# EAGLE schematic zulu_a7 (EAGLE 9.7.0), part 1 of 2
AUTHOR: Christian Tambe; VERSION#: 1.0

## Sheet 1 of 7: Block Diagram
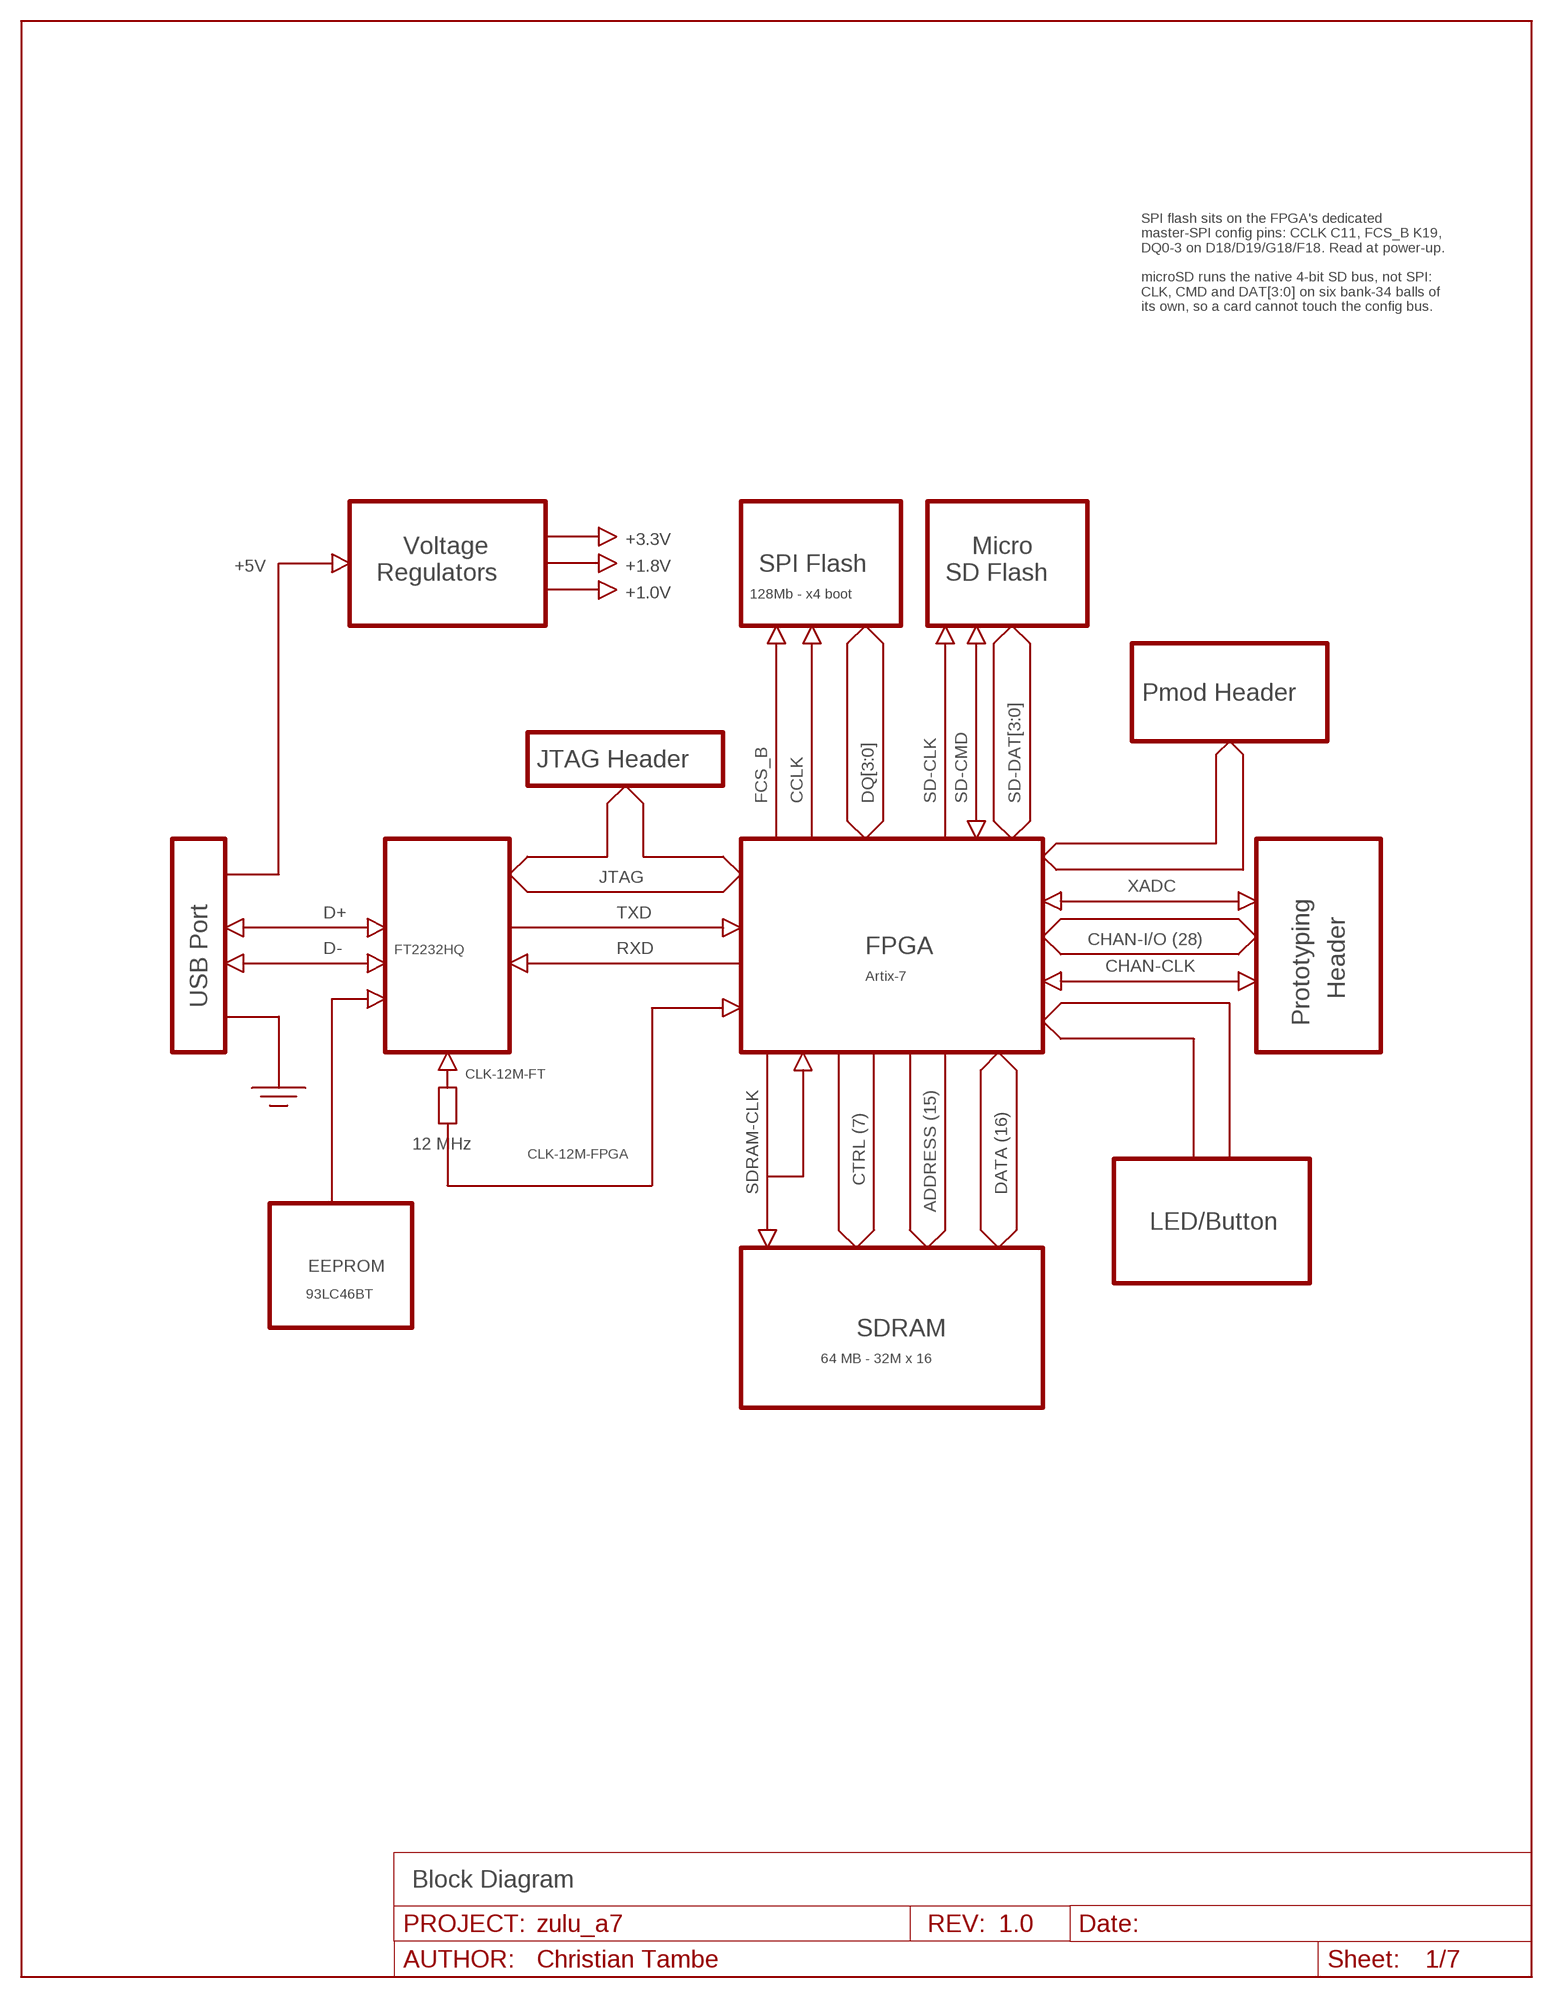
[diagram p0: schematic, sheet 1]

### Notes on the sheet
- SPI flash sits on the FPGA's dedicated
  master-SPI config pins: CCLK C11, FCS_B K19,
  DQ0-3 on D18/D19/G18/F18. Read at power-up.
  
  microSD runs the native 4-bit SD bus, not SPI:
  CLK, CMD and DAT[3:0] on six bank-34 balls of
  its own, so a card cannot touch the config bus.
- +3.3V
- Voltage | Micro
- +5V | +1.8V | SPI Flash
- Regulators | SD Flash
- +1.0V | 128Mb - x4 boot
- Pmod Header
- JTAG Header
- FCS_B | CCLK | DQ[3:0] | SD-CLK | SD-CMD | SD-DAT[3:0]
- JTAG
- XADC
- D+ | TXD
- CHAN-I/O (28)
- D- | FT2232HQ | RXD | FPGA
- CHAN-CLK
- Artix-7
- Header
- USB Port
- Prototyping
- CLK-12M-FT
- 12 MHz
- CLK-12M-FPGA
- CTRL (7)
- SDRAM-CLK | DATA (16)
- ADDRESS (15)
- LED/Button
- EEPROM
- 93LC46BT
- SDRAM
- 64 MB - 32M x 16
- Block Diagram

## Sheet 2 of 7: Power Supplies
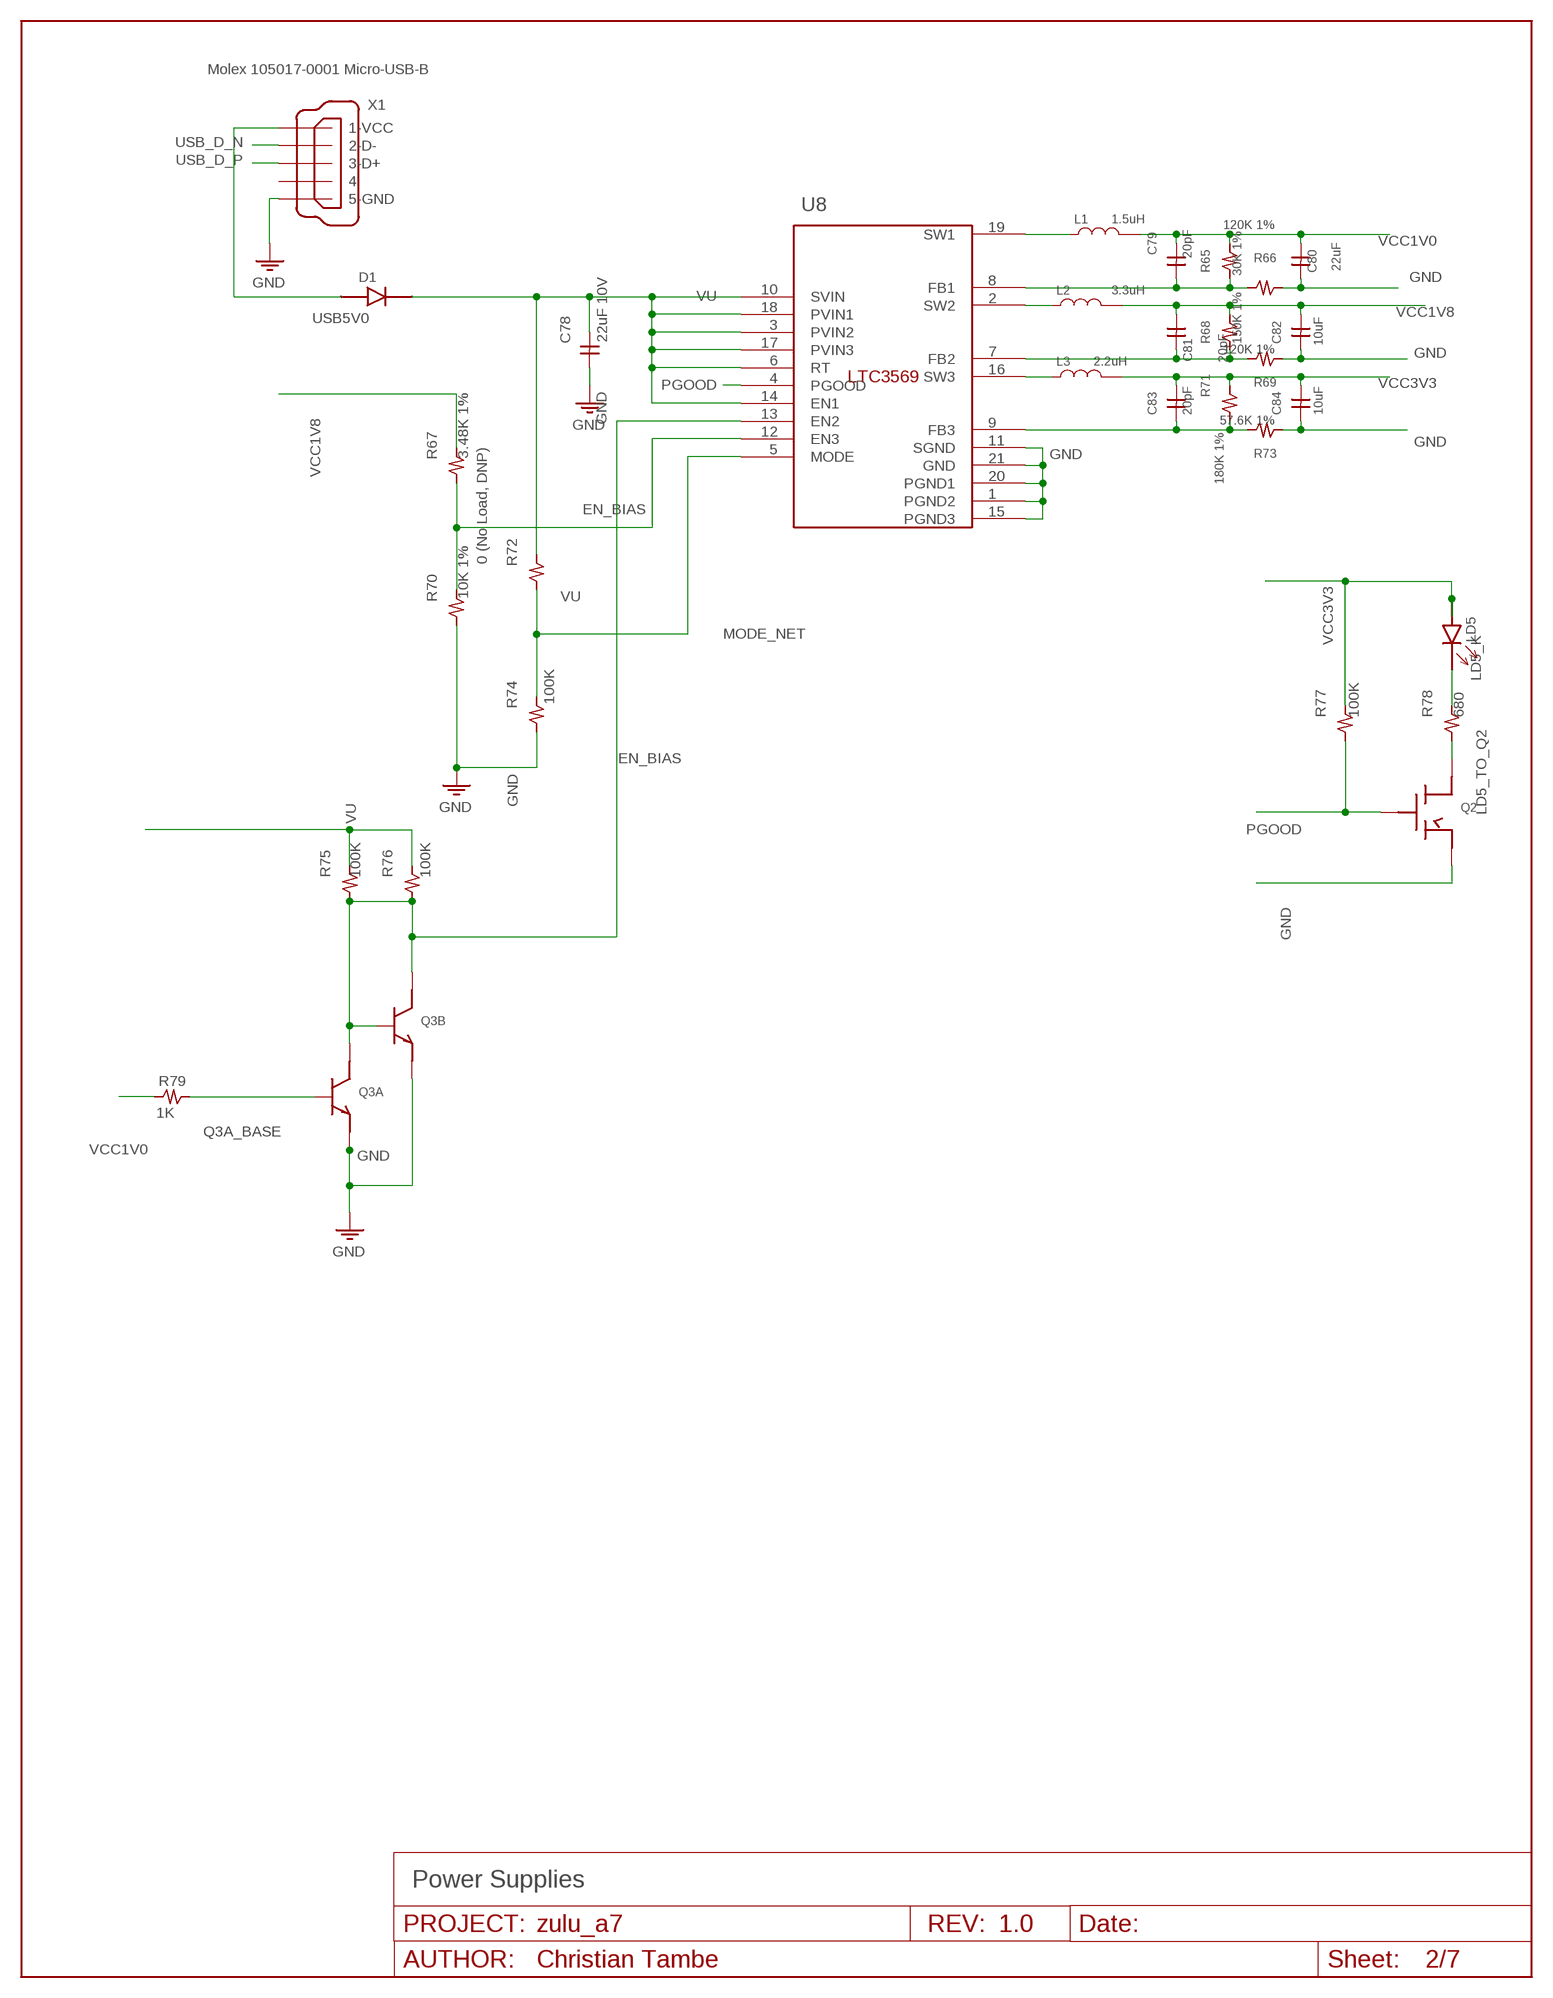
[diagram p1: schematic, sheet 2]

### Parts
C78  22uF 10V  C-GENERICC0805  [C0805]
C79  20pF  C-GENERICC0402  [C0402]
C80  22uF  C-GENERICC0805  [C0805]
C81  20pF  C-GENERICC0402  [C0402]
C82  10uF  C-GENERICC0603  [C0603]
C83  20pF  C-GENERICC0402  [C0402]
C84  10uF  C-GENERICC0603  [C0603]
D1  PMEG2020EJ,115  DIODE  [SOD123]
L1  1.5uH  INDUCTOR-2520  [IND2520]
L2  3.3uH  INDUCTOR-2520  [IND2520]
L3  2.2uH  INDUCTOR-2520  [IND2520]
LD5  green  LED  [LED0603]
Q2  2N7002  NMOS  [SOT23-3]
Q3  MBT3904DW1T1  NPN-DUAL  [SOT363]
R65  30K 1%  R-US_SMALLR0402  [R0402]
R66  120K 1%  R-US_SMALLR0402  [R0402]
R67  3.48K 1%  R-US_SMALLR0402  [R0402]
R68  150K 1%  R-US_SMALLR0402  [R0402]
R69  120K 1%  R-US_SMALLR0402  [R0402]
R70  10K 1%  R-US_SMALLR0402  [R0402]
R71  180K 1%  R-US_SMALLR0402  [R0402]
R72  0 (No Load, DNP)  R-US_SMALLR0402  [R0402]
R73  57.6K 1%  R-US_SMALLR0402  [R0402]
R74  100K  R-US_SMALLR0402  [R0402]
R75  100K  R-US_SMALLR0402  [R0402]
R76  100K  R-US_SMALLR0402  [R0402]
R77  100K  R-US_SMALLR0402  [R0402]
R78  680  R-US_SMALLR0402  [R0402]
R79  1K  R-US_SMALLR0402  [R0402]
U8  LTC3569EUDC#TRPBF  LTC3569-UDC  [LTC3569-QFN20]
X1  Molex 105017-0001 Micro-USB-B  MINI-USB-105017-0001  [MOLEX-105017-0001]

### Nets
EN_BIAS: Q3.4(B:B) Q3.5(B:C) Q3.6(A:C) R67.1 R70.2 R75.1 R76.1 U8.12(EN3) U8.13(EN2)
FB1_NODE: C79.1 R65.1 R66.2 U8.8(FB1)
FB2_NODE: C81.1 R68.1 R69.2 U8.7(FB2)
FB3_NODE: C83.1 R71.1 R73.2 U8.9(FB3)
GND: C78.1 C80.1 C82.1 C84.1 Q2.S Q3.2(A:E) Q3.3(B:E) R66.1 R69.1 R70.1 R73.1 R74.1 U8.1(PGND2) U8.11(SGND) U8.15(PGND3) U8.20(PGND1) U8.21(GND) X1.5(5-GND) X1.MH1(5-GND) X1.MH2(5-GND) X1.MP1(5-GND) X1.MP2(5-GND) X1.MP3(5-GND) X1.MP4(5-GND) X1.MS1(5-GND) X1.MS2(5-GND) ; also sheet 3,4,5,6,7
LD5_K: LD5.K R78.2
LD5_TO_Q2: Q2.D R78.1
MODE_NET: R72.1 R74.2 U8.5(MODE)
PGOOD: Q2.G R77.1 U8.4(PGOOD)
Q3A_BASE: Q3.1(A:B) R79.2
SW1_NET: L1.1 U8.19(SW1)
SW2_NET: L2.1 U8.2(SW2)
SW3_NET: L3.1 U8.16(SW3)
USB5V0: D1.A X1.1(1-VCC)
USB_D_N [usb-diff]: X1.2(2-D-) ; also sheet 5
USB_D_P [usb-diff]: X1.3(3-D+) ; also sheet 5
VCC1V0: C79.2 C80.2 L1.2 R65.2 R79.1 ; also sheet 3,6,7
VCC1V8: C81.2 C82.2 L2.2 R67.2 R68.2 ; also sheet 3,6,7
VCC3V3: C83.2 C84.2 L3.2 LD5.A R71.2 R77.2 ; also sheet 3,4,5,6,7
VU: C78.2 D1.K R72.2 R75.2 R76.2 U8.3(PVIN2) U8.6(RT) U8.10(SVIN) U8.14(EN1) U8.17(PVIN3) U8.18(PVIN1) ; also sheet 3
Unconnected: X1.4

### Notes on the sheet
- Power Supplies

## Sheet 3 of 7: General IO
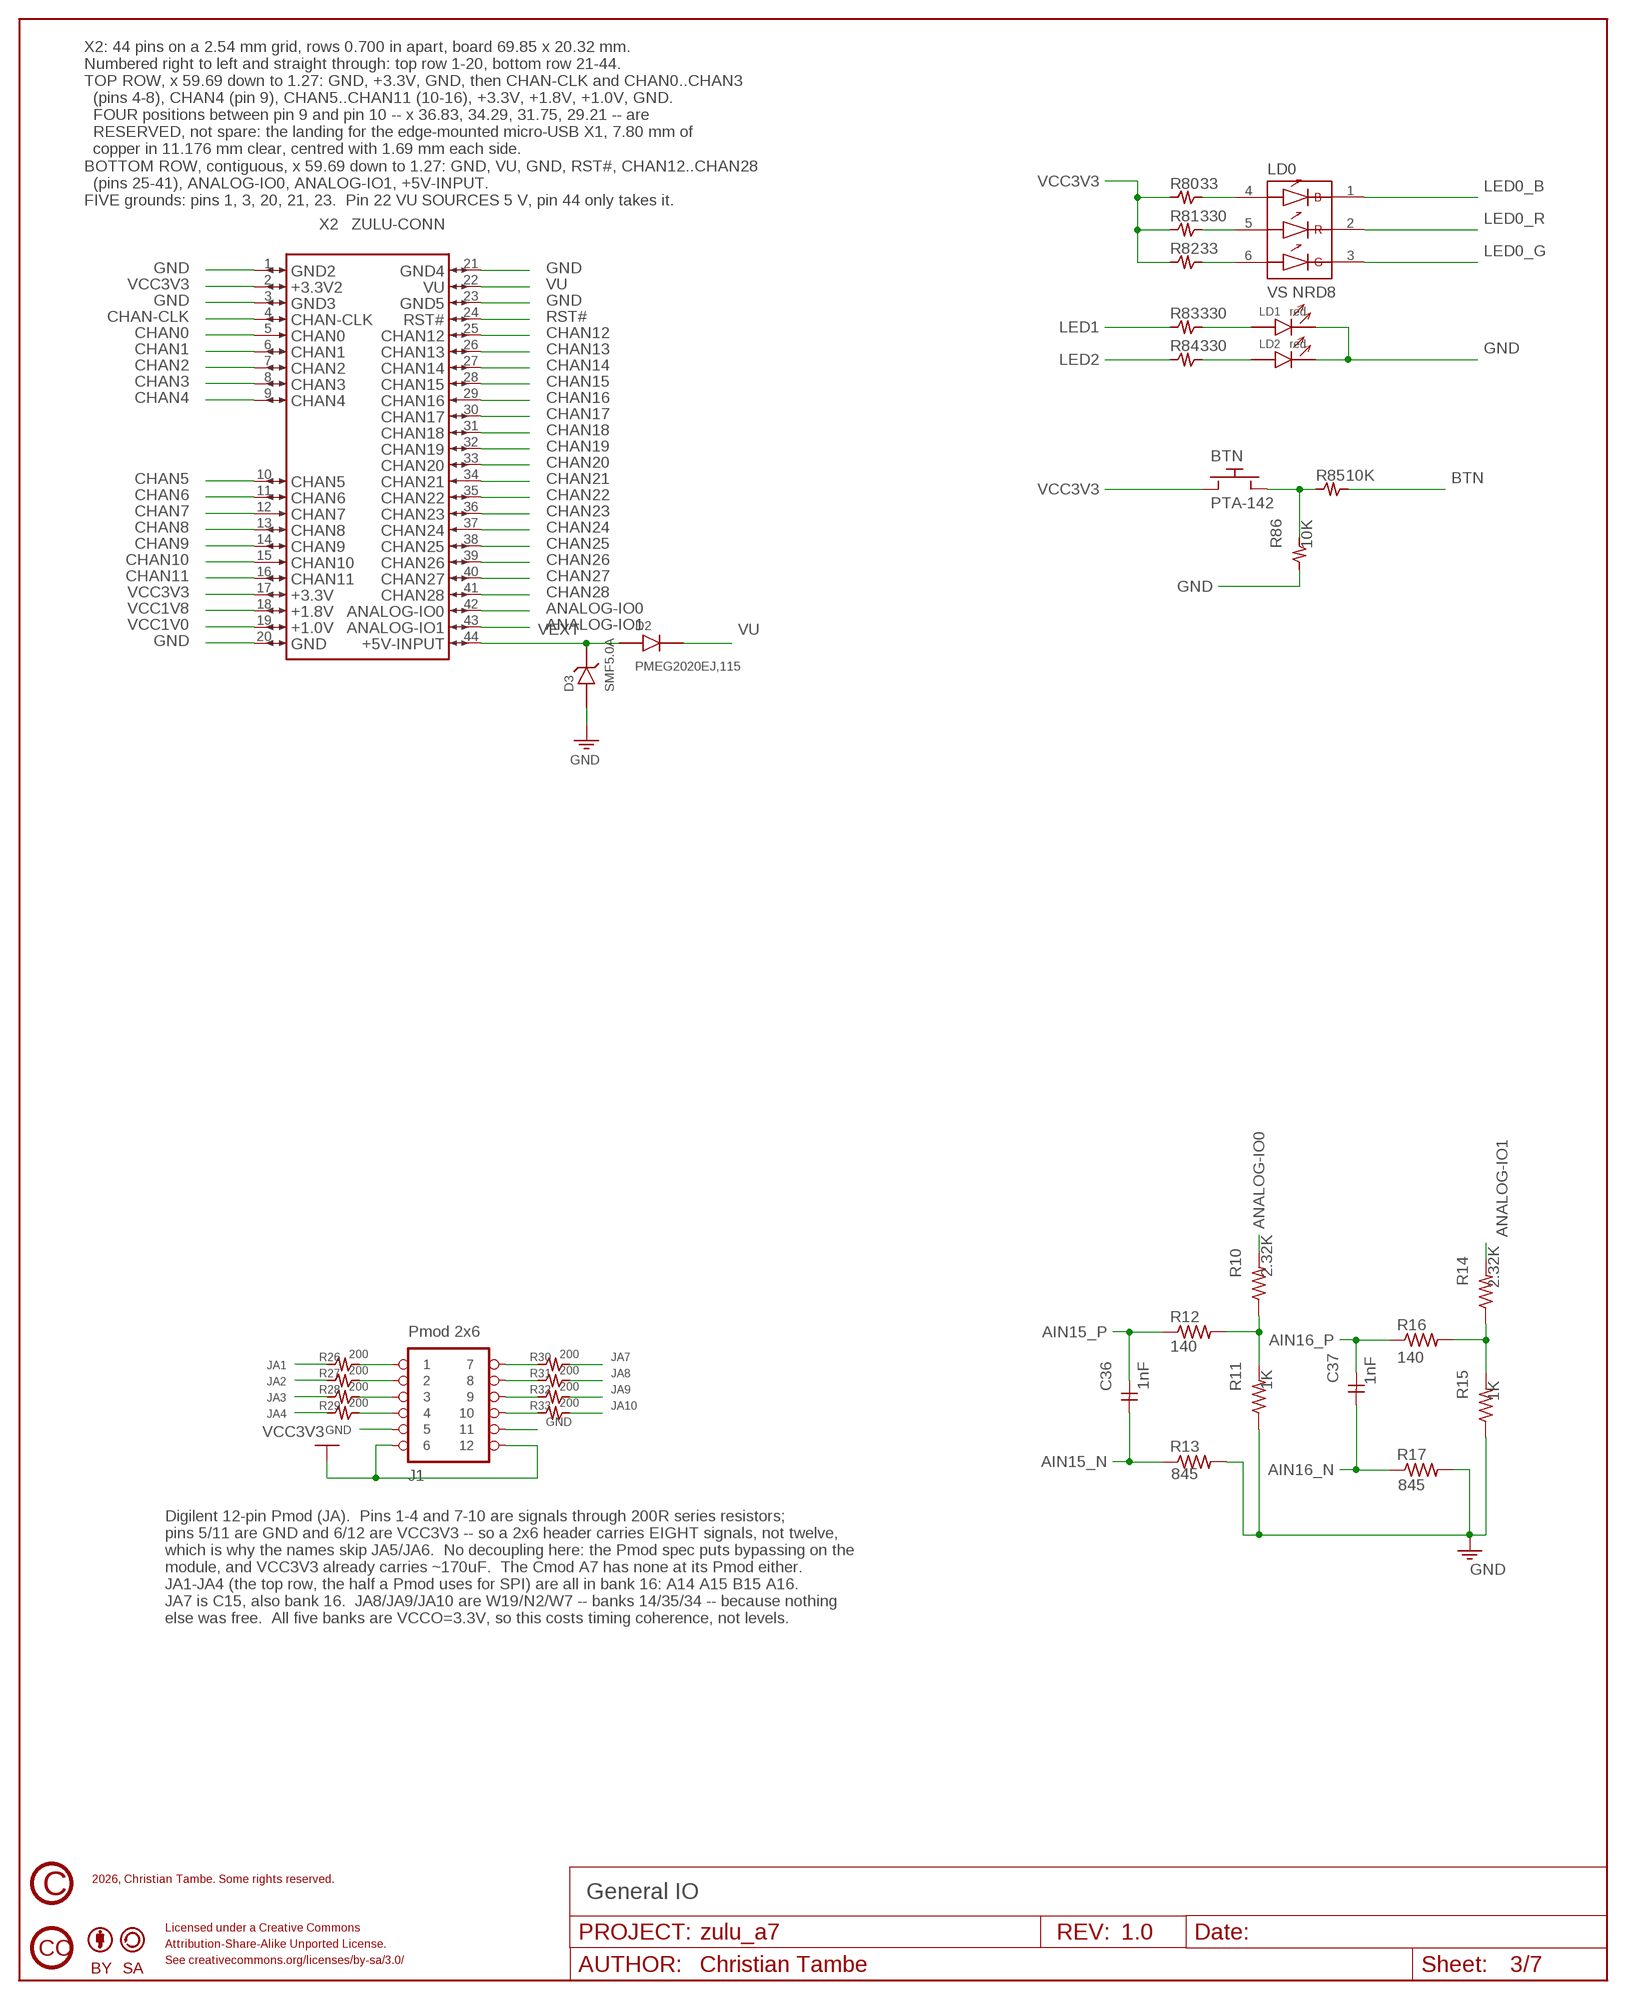
[diagram p2: schematic, sheet 3]

### Parts
BTN  PTA-142  SWITCH_TACT  [PTA-142]
C36  1nF  C-GENERICC0402  [C0402]
C37  1nF  C-GENERICC0402  [C0402]
D2  PMEG2020EJ,115  DIODE  [SOD123]
D3  SMF5.0A  TVS  [SOD123]
J1  Pmod 2x6  PINHD-2X6  [2X06]
LD0  VS NRD8  LED_RGB  [VS-NRD8]
LD1  red  LED  [LED0603]
LD2  red  LED  [LED0603]
R10  2.32K  R-US_R0201  [R0201]
R11  1K  R-US_R0201  [R0201]
R12  140  R-US_R0201  [R0201]
R13  845  R-US_R0201  [R0201]
R14  2.32K  R-US_R0201  [R0201]
R15  1K  R-US_R0201  [R0201]
R16  140  R-US_R0201  [R0201]
R17  845  R-US_R0201  [R0201]
R26  200  R-US_SMALLR0201  [R0201]
R27  200  R-US_SMALLR0201  [R0201]
R28  200  R-US_SMALLR0201  [R0201]
R29  200  R-US_SMALLR0201  [R0201]
R30  200  R-US_SMALLR0201  [R0201]
R31  200  R-US_SMALLR0201  [R0201]
R32  200  R-US_SMALLR0201  [R0201]
R33  200  R-US_SMALLR0201  [R0201]
R80  33  R-US_SMALLR0402  [R0402]
R81  330  R-US_SMALLR0402  [R0402]
R82  33  R-US_SMALLR0402  [R0402]
R83  330  R-US_SMALLR0402  [R0402]
R84  330  R-US_SMALLR0402  [R0402]
R85  10K  R-US_SMALLR0402  [R0402]
R86  10K  R-US_SMALLR0402  [R0402]
U$2  CC_CC  [CC_CC]
U$3  CC_BY  [CC_BY]
U$4  CC_SA  [CC_SA]
U$5  CC_COPYRIGHT  [CC_COPYRIGHT]
X2  ZULU-CONN  [ZULU-DIP37]

### Nets
AIN15_N: C36.1 R13.1 ; also sheet 6
AIN15_P: C36.2 R12.1 ; also sheet 6
AIN16_N: C37.1 R17.1 ; also sheet 6
AIN16_P: C37.2 R16.1 ; also sheet 6
ANALOG-IO0: R10.2 X2.42
ANALOG-IO1: R14.2 X2.43
BTN: R85.2 ; also sheet 6
CHAN0: X2.5 ; also sheet 6
CHAN1: X2.6 ; also sheet 6
CHAN2: X2.7 ; also sheet 6
CHAN3: X2.8 ; also sheet 6
CHAN4: X2.9 ; also sheet 6
CHAN5: X2.10 ; also sheet 6
CHAN6: X2.11 ; also sheet 6
CHAN7: X2.12 ; also sheet 6
CHAN8: X2.13 ; also sheet 6
CHAN9: X2.14 ; also sheet 6
CHAN10: X2.15 ; also sheet 6
CHAN11: X2.16 ; also sheet 6
CHAN12: X2.25 ; also sheet 6
CHAN13: X2.26 ; also sheet 6
CHAN14: X2.27 ; also sheet 6
CHAN15: X2.28 ; also sheet 6
CHAN16: X2.29 ; also sheet 6
CHAN17: X2.30 ; also sheet 6
CHAN18: X2.31 ; also sheet 6
CHAN19: X2.32 ; also sheet 6
CHAN20: X2.33 ; also sheet 6
CHAN21: X2.34 ; also sheet 6
CHAN22: X2.35 ; also sheet 6
CHAN23: X2.36 ; also sheet 6
CHAN24: X2.37 ; also sheet 6
CHAN25: X2.38 ; also sheet 6
CHAN26: X2.39 ; also sheet 6
CHAN27: X2.40 ; also sheet 6
CHAN28: X2.41 ; also sheet 6
CHAN-CLK: X2.4 ; also sheet 6
GND: D3.A J1.5 J1.11 LD1.K LD2.K R11.1 R13.2 R15.1 R17.2 R86.1 X2.1 X2.3 X2.20 X2.21 X2.23 ; also sheet 2,4,5,6,7
JA1: R26.1 ; also sheet 6
JA2: R27.1 ; also sheet 6
JA3: R28.1 ; also sheet 6
JA4: R29.1 ; also sheet 6
JA7: R30.2 ; also sheet 6
JA8: R31.2 ; also sheet 6
JA9: R32.2 ; also sheet 6
JA10: R33.2 ; also sheet 6
LED0_B: LD0.1 ; also sheet 6
LED0_G: LD0.3 ; also sheet 6
LED0_R: LD0.2 ; also sheet 6
LED1: R83.1 ; also sheet 6
LED2: R84.1 ; also sheet 6
N$BTN: BTN.3 BTN.4 R85.1 R86.2
N$LD0B: LD0.4 R80.2
N$LD0G: LD0.6 R82.2
N$LD0R: LD0.5 R81.2
N$LD1A: LD1.A R83.2
N$LD2A: LD2.A R84.2
NODE_P0: R10.1 R11.2 R12.2
NODE_P1: R14.1 R15.2 R16.2
PMOD-1: J1.1 R26.2
PMOD-2: J1.2 R27.2
PMOD-3: J1.3 R28.2
PMOD-4: J1.4 R29.2
PMOD-7: J1.7 R30.1
PMOD-8: J1.8 R31.1
PMOD-9: J1.9 R32.1
PMOD-10: J1.10 R33.1
RST#: X2.24 ; also sheet 5,6
VCC1V0: X2.19 ; also sheet 2,6,7
VCC1V8: X2.18 ; also sheet 2,6,7
VCC3V3: BTN.1 BTN.2 J1.6 J1.12 R80.1 R81.1 R82.1 X2.2 X2.17 ; also sheet 2,4,5,6,7
VEXT: D2.A D3.K X2.44
VU: D2.K X2.22 ; also sheet 2

### Notes on the sheet
- X2: 44 pins on a 2.54 mm grid, rows 0.700 in apart, board 69.85 x 20.32 mm.
  Numbered right to left and straight through: top row 1-20, bottom row 21-44.
  TOP ROW, x 59.69 down to 1.27: GND, +3.3V, GND, then CHAN-CLK and CHAN0..CHAN3
    (pins 4-8), CHAN4 (pin 9), CHAN5..CHAN11 (10-16), +3.3V, +1.8V, +1.0V, GND.
    FOUR positions between pin 9 and pin 10 -- x 36.83, 34.29, 31.75, 29.21 -- are
    RESERVED, not spare: the landing for the edge-mounted micro-USB X1, 7.80 mm of
    copper in 11.176 mm clear, centred with 1.69 mm each side.
  BOTTOM ROW, contiguous, x 59.69 down to 1.27: GND, VU, GND, RST#, CHAN12..CHAN28
    (pins 25-41), ANALOG-IO0, ANALOG-IO1, +5V-INPUT.
  FIVE grounds: pins 1, 3, 20, 21, 23.  Pin 22 VU SOURCES 5 V, pin 44 only takes it.
- Digilent 12-pin Pmod (JA).  Pins 1-4 and 7-10 are signals through 200R series resistors;
  pins 5/11 are GND and 6/12 are VCC3V3 -- so a 2x6 header carries EIGHT signals, not twelve,
  which is why the names skip JA5/JA6.  No decoupling here: the Pmod spec puts bypassing on the
  module, and VCC3V3 already carries ~170uF.  The Cmod A7 has none at its Pmod either.
  JA1-JA4 (the top row, the half a Pmod uses for SPI) are all in bank 16: A14 A15 B15 A16.
  JA7 is C15, also bank 16.  JA8/JA9/JA10 are W19/N2/W7 -- banks 14/35/34 -- because nothing
  else was free.  All five banks are VCCO=3.3V, so this costs timing coherence, not levels.
- 2026, Christian Tambe. Some rights reserved.
- General IO
- Licensed under a Creative Commons
- Attribution-Share-Alike Unported License.
- See creativecommons.org/licenses/by-sa/3.0/

## Sheet 4 of 7: Memory
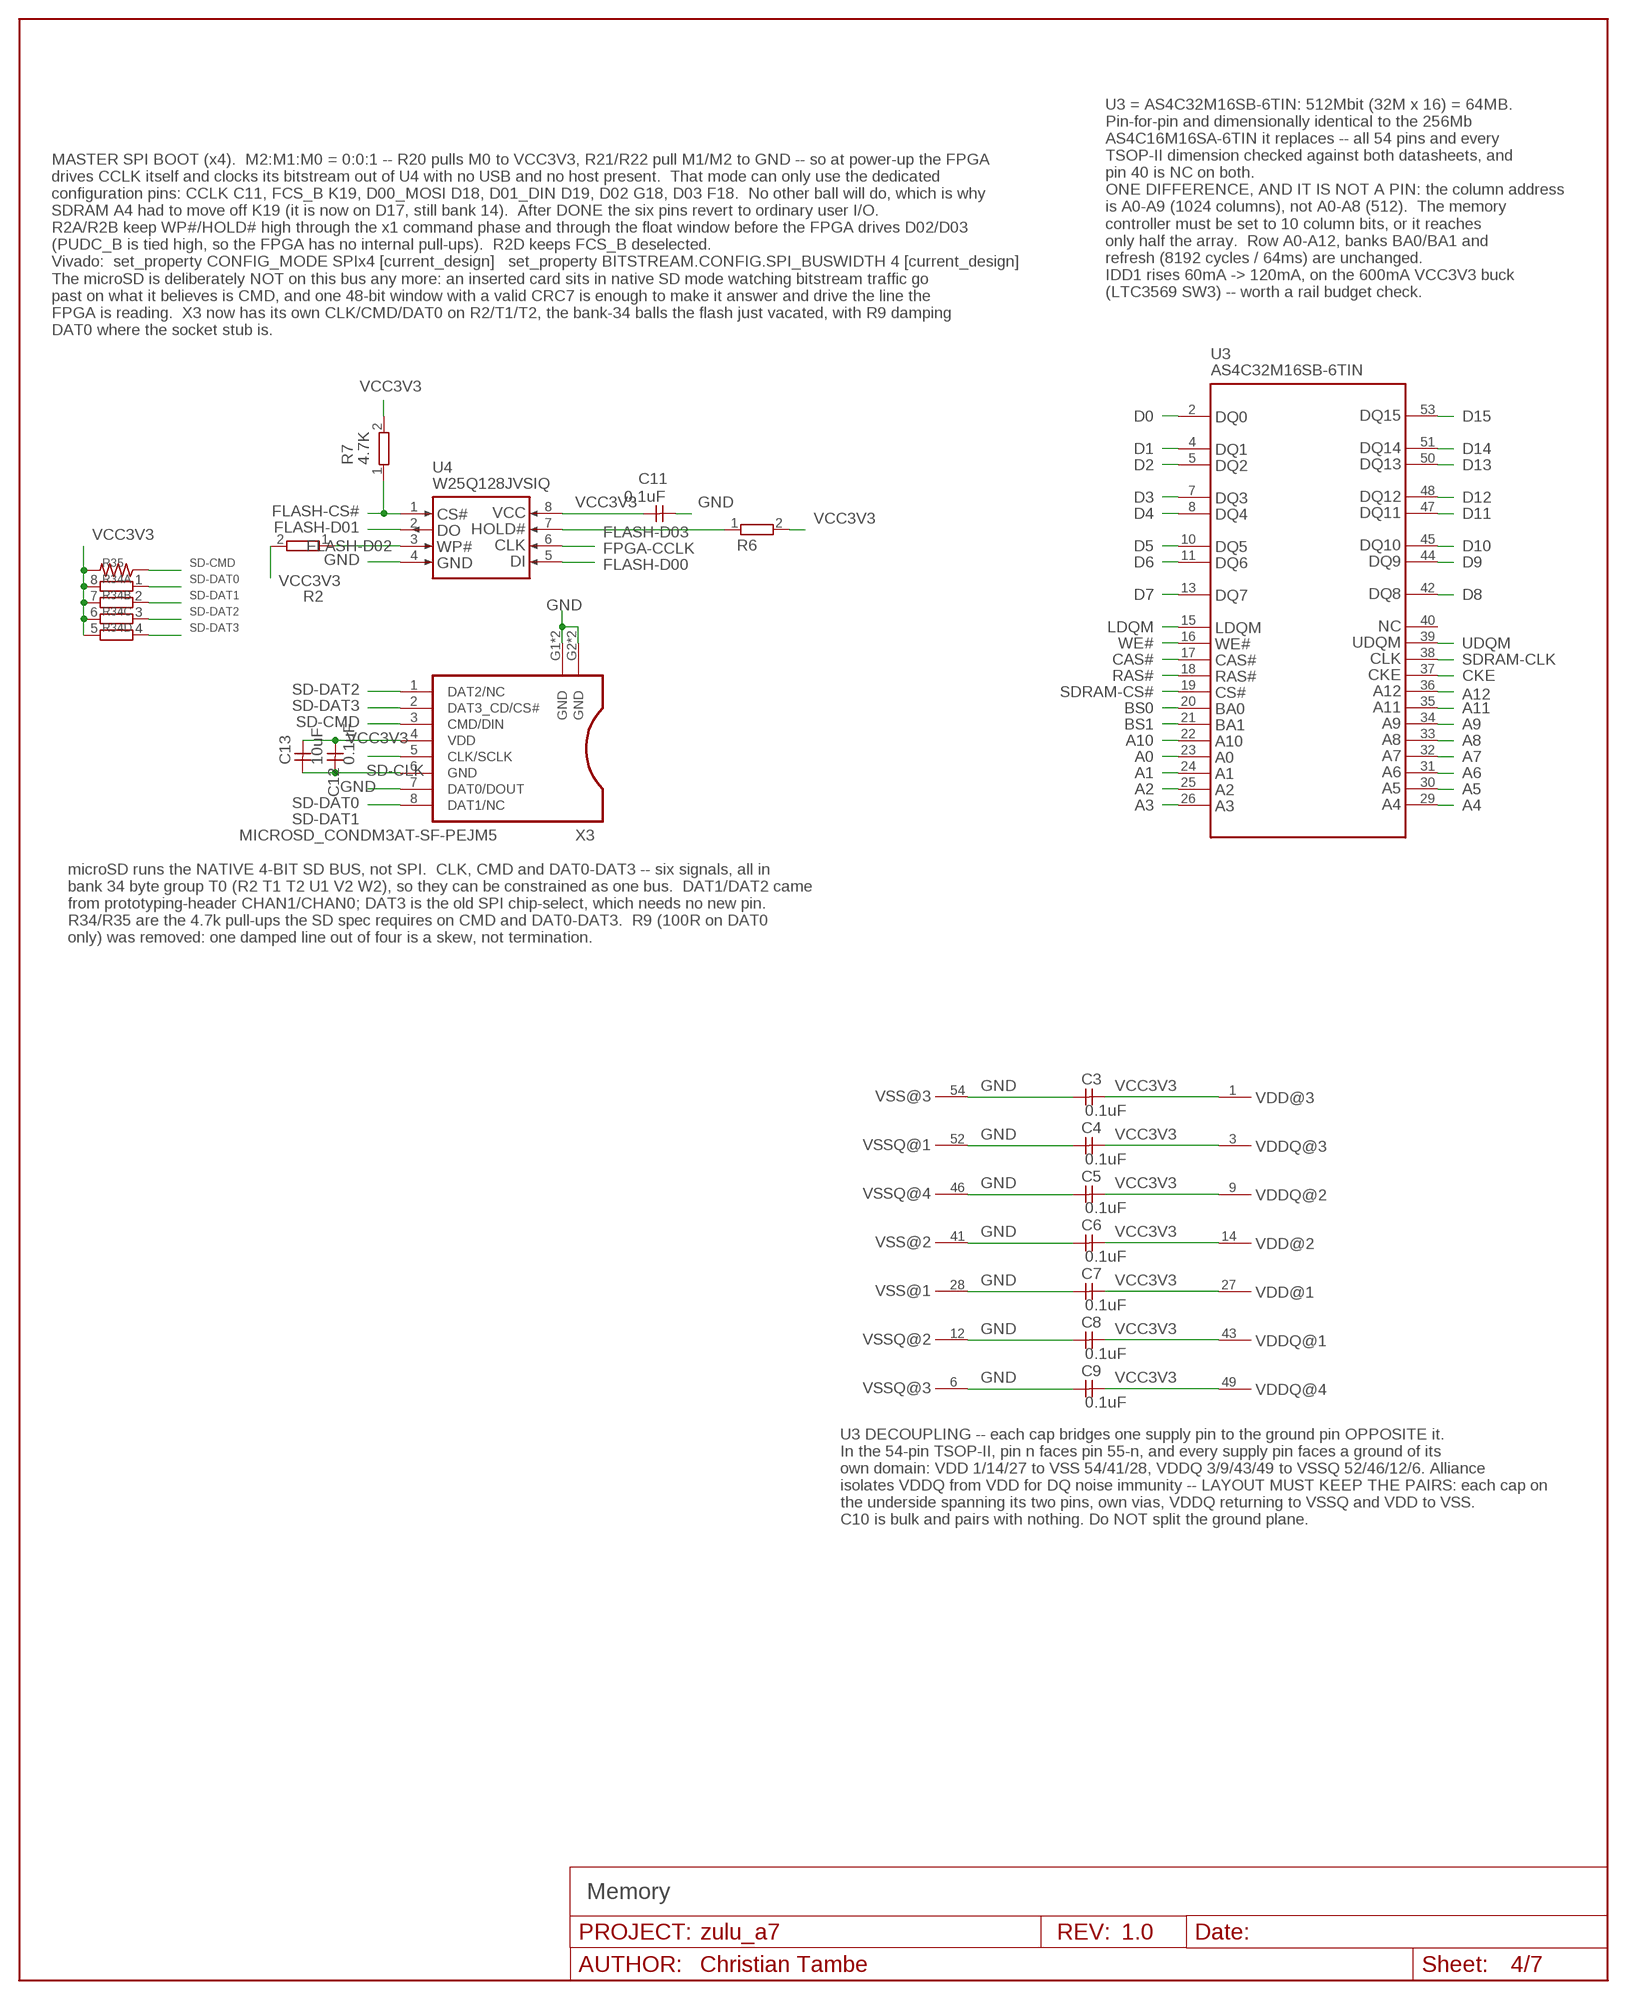
[diagram p3: schematic, sheet 4]

### Parts
C3  0.1uF  C-GENERICC0402  [C0402]
C4  0.1uF  C-GENERICC0402  [C0402]
C5  0.1uF  C-GENERICC0402  [C0402]
C6  0.1uF  C-GENERICC0402  [C0402]
C7  0.1uF  C-GENERICC0402  [C0402]
C8  0.1uF  C-GENERICC0402  [C0402]
C9  0.1uF  C-GENERICC0402  [C0402]
C11  0.1uF  C-GENERICC0402  [C0402]
C12  0.1uF  C-GENERICC0402  [C0402]
C13  10uF  C-GENERICC0603  [C0603]
R2  4.7K  R-WIDER0201  [R0201]
R6  4.7K  R-WIDER0201  [R0201]
R7  4.7K  R-WIDER0201  [R0201]
R34  4.7K  RES4742  [742C083]
R35  4.7K  R-US_R0402  [R0402]
U3  AS4C32M16SB-6TIN  SDRAM-X16-ALLIANCE-512M  [TSOPII-54]
U4  W25Q128JVSIQ  SPI_FLASH-SOIC_150_208  [SOIC-8_208MIL]
X3  MICROSD_CONDM3AT-SF-PEJM5  [DM3AT-SF-PEJM5]

### Nets
A0: U3.23 ; also sheet 6
A1: U3.24 ; also sheet 6
A2: U3.25 ; also sheet 6
A3: U3.26 ; also sheet 6
A4: U3.29 ; also sheet 6
A5: U3.30 ; also sheet 6
A6: U3.31 ; also sheet 6
A7: U3.32 ; also sheet 6
A8: U3.33 ; also sheet 6
A9: U3.34 ; also sheet 6
A10: U3.22 ; also sheet 6
A11: U3.35 ; also sheet 6
A12: U3.36 ; also sheet 6
BS0: U3.20 ; also sheet 6
BS1: U3.21 ; also sheet 6
CAS#: U3.17 ; also sheet 6
CKE: U3.37 ; also sheet 6
D0: U3.2 ; also sheet 6
D1: U3.4 ; also sheet 6
D2: U3.5 ; also sheet 6
D3: U3.7 ; also sheet 6
D4: U3.8 ; also sheet 6
D5: U3.10 ; also sheet 6
D6: U3.11 ; also sheet 6
D7: U3.13 ; also sheet 6
D8: U3.42 ; also sheet 6
D9: U3.44 ; also sheet 6
D10: U3.45 ; also sheet 6
D11: U3.47 ; also sheet 6
D12: U3.48 ; also sheet 6
D13: U3.50 ; also sheet 6
D14: U3.51 ; also sheet 6
D15: U3.53 ; also sheet 6
FLASH-CS#: R7.1 U4.1 ; also sheet 6
FLASH-D00: U4.5 ; also sheet 6
FLASH-D01: U4.2 ; also sheet 6
FLASH-D02: R2.1 U4.3 ; also sheet 6
FLASH-D03: R6.1 U4.7 ; also sheet 6
FPGA-CCLK: U4.6 ; also sheet 6
GND: C3.1 C4.1 C5.1 C6.1 C7.1 C8.1 C9.1 C11.1 C12.1 C13.1 U3.6 U3.12 U3.28 U3.41 U3.46 U3.52 U3.54 U4.4 X3.6(GND) X3.G1(GND) X3.G2(GND) X3.G3(GND) X3.G4(GND) ; also sheet 2,3,5,6,7
LDQM: U3.15 ; also sheet 6
RAS#: U3.18 ; also sheet 6
SD-CLK: X3.5(CLK/SCLK) ; also sheet 6
SD-CMD: R35.1 X3.3(CMD/DIN) ; also sheet 6
SD-DAT0: R34.1 X3.7(DAT0/DOUT) ; also sheet 6
SD-DAT1: R34.2 X3.8(DAT1/NC) ; also sheet 6
SD-DAT2: R34.3 X3.1(DAT2/NC) ; also sheet 6
SD-DAT3: R34.4 X3.2(DAT3_CD/CS#) ; also sheet 6
SDRAM-CLK: U3.38 ; also sheet 6
SDRAM-CS#: U3.19 ; also sheet 6
UDQM: U3.39 ; also sheet 6
VCC3V3: C3.2 C4.2 C5.2 C6.2 C7.2 C8.2 C9.2 C11.2 C12.2 C13.2 R2.2 R6.2 R7.2 R34.5 R34.6 R34.7 R34.8 R35.2 U3.1 U3.3 U3.9 U3.14 U3.27 U3.43 U3.49 U4.8 X3.4(VDD) ; also sheet 2,3,5,6,7
WE#: U3.16 ; also sheet 6
Unconnected: U3.40

### Notes on the sheet
- U3 = AS4C32M16SB-6TIN: 512Mbit (32M x 16) = 64MB.
  Pin-for-pin and dimensionally identical to the 256Mb
  AS4C16M16SA-6TIN it replaces -- all 54 pins and every
  TSOP-II dimension checked against both datasheets, and
  pin 40 is NC on both.
  ONE DIFFERENCE, AND IT IS NOT A PIN: the column address
  is A0-A9 (1024 columns), not A0-A8 (512).  The memory
  controller must be set to 10 column bits, or it reaches
  only half the array.  Row A0-A12, banks BA0/BA1 and
  refresh (8192 cycles / 64ms) are unchanged.
  IDD1 rises 60mA -> 120mA, on the 600mA VCC3V3 buck
  (LTC3569 SW3) -- worth a rail budget check.
- MASTER SPI BOOT (x4).  M2:M1:M0 = 0:0:1 -- R20 pulls M0 to VCC3V3, R21/R22 pull M1/M2 to GND -- so at power-up the FPGA
  drives CCLK itself and clocks its bitstream out of U4 with no USB and no host present.  That mode can only use the dedicated
  configuration pins: CCLK C11, FCS_B K19, D00_MOSI D18, D01_DIN D19, D02 G18, D03 F18.  No other ball will do, which is why
  SDRAM A4 had to move off K19 (it is now on D17, still bank 14).  After DONE the six pins revert to ordinary user I/O.
  R2A/R2B keep WP#/HOLD# high through the x1 command phase and through the float window before the FPGA drives D02/D03
  (PUDC_B is tied high, so the FPGA has no internal pull-ups).  R2D keeps FCS_B deselected.
  Vivado:  set_property CONFIG_MODE SPIx4 [current_design]   set_property BITSTREAM.CONFIG.SPI_BUSWIDTH 4 [current_design]
  The microSD is deliberately NOT on this bus any more: an inserted card sits in native SD mode watching bitstream traffic go
  past on what it believes is CMD, and one 48-bit window with a valid CRC7 is enough to make it answer and drive the line the
  FPGA is reading.  X3 now has its own CLK/CMD/DAT0 on R2/T1/T2, the bank-34 balls the flash just vacated, with R9 damping
  DAT0 where the socket stub is.
- microSD runs the NATIVE 4-BIT SD BUS, not SPI.  CLK, CMD and DAT0-DAT3 -- six signals, all in
  bank 34 byte group T0 (R2 T1 T2 U1 V2 W2), so they can be constrained as one bus.  DAT1/DAT2 came
  from prototyping-header CHAN1/CHAN0; DAT3 is the old SPI chip-select, which needs no new pin.
  R34/R35 are the 4.7k pull-ups the SD spec requires on CMD and DAT0-DAT3.  R9 (100R on DAT0
  only) was removed: one damped line out of four is a skew, not termination.
- U3 DECOUPLING -- each cap bridges one supply pin to the ground pin OPPOSITE it.
  In the 54-pin TSOP-II, pin n faces pin 55-n, and every supply pin faces a ground of its
  own domain: VDD 1/14/27 to VSS 54/41/28, VDDQ 3/9/43/49 to VSSQ 52/46/12/6. Alliance
  isolates VDDQ from VDD for DQ noise immunity -- LAYOUT MUST KEEP THE PAIRS: each cap on
  the underside spanning its two pins, own vias, VDDQ returning to VSSQ and VDD to VSS.
  C10 is bulk and pairs with nothing. Do NOT split the ground plane.
- Memory

## Sheet 5 of 7: FT2232HQ, JTAG, CLOCK
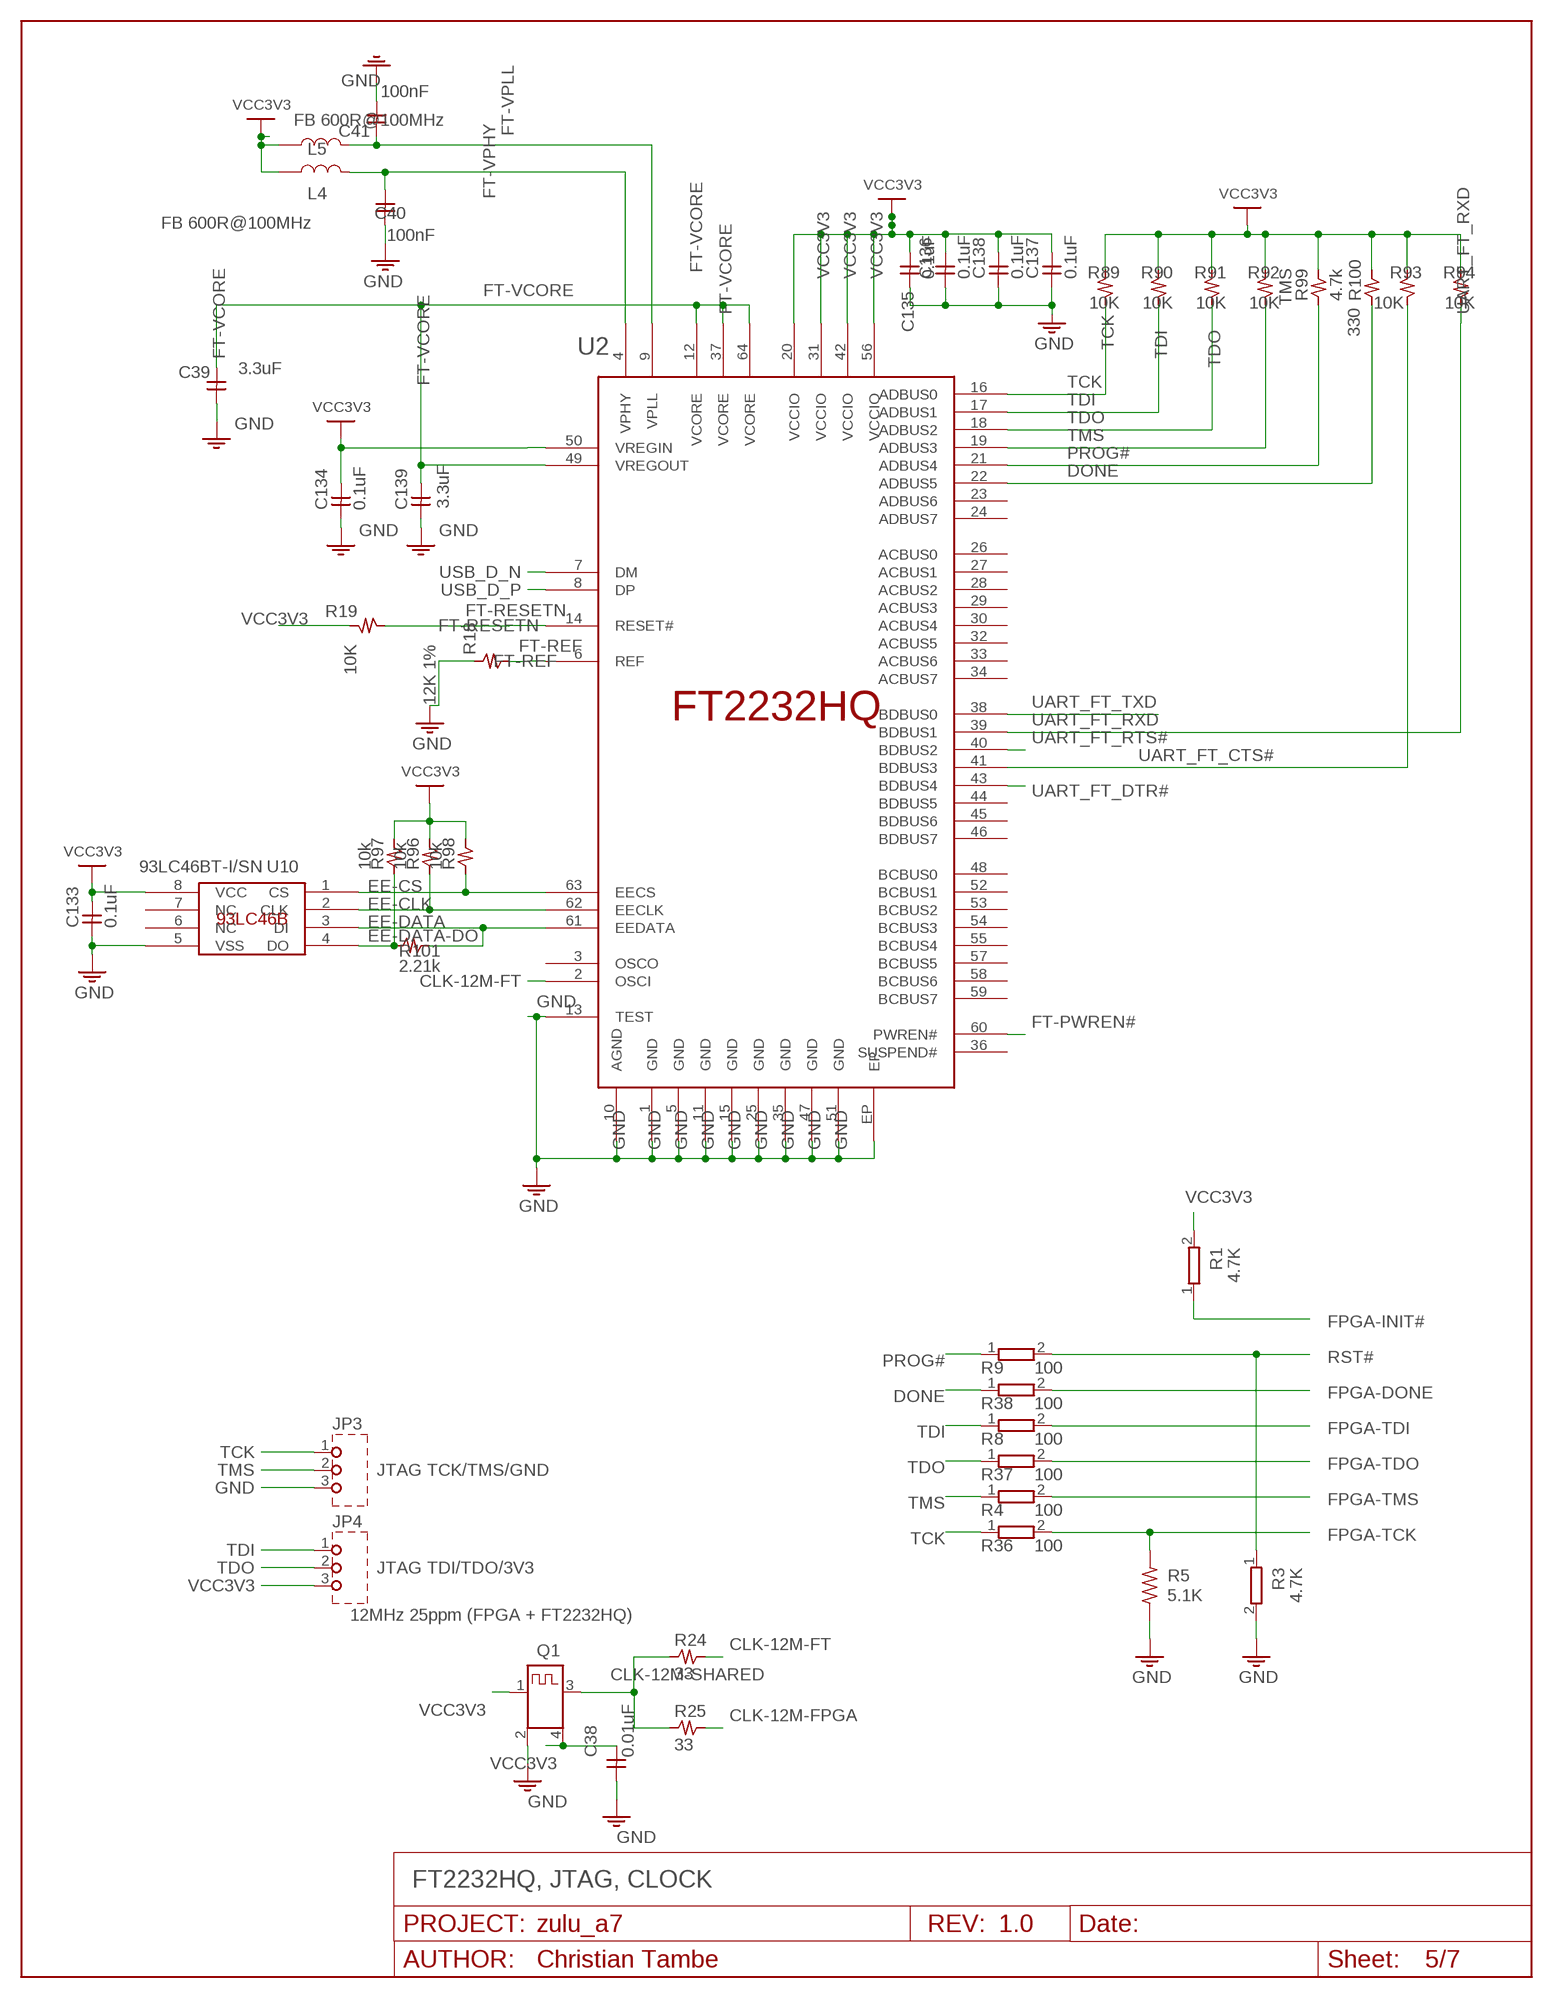
[diagram p4: schematic, sheet 5]

### Parts
C38  0.01uF  C-GENERICC0201  [C0201]
C39  3.3uF  C-GENERICC0402  [C0402]
C40  100nF  C-GENERICC0201  [C0201]
C41  100nF  C-GENERICC0201  [C0201]
C133  0.1uF  C-GENERICC0201  [C0201]
C134  0.1uF  C-GENERICC0201  [C0201]
C135  0.1uF  C-GENERICC0201  [C0201]
C136  0.1uF  C-GENERICC0201  [C0201]
C137  0.1uF  C-GENERICC0201  [C0201]
C138  0.1uF  C-GENERICC0201  [C0201]
C139  3.3uF  C-GENERICC0402  [C0402]
JP3  JTAG TCK/TMS/GND  TESTPT-1X3NOSILK  [1X03-NOSILK]
JP4  JTAG TDI/TDO/3V3  TESTPT-1X3NOSILK  [1X03-NOSILK]
L4  FB 600R@100MHz  INDUCTOR  [IND0603]
L5  FB 600R@100MHz  INDUCTOR  [IND0603]
Q1  12MHz 25ppm (FPGA + FT2232HQ)  OSC_CHIPASEM1-12MHZ  [32X25]
R1  4.7K  R-WIDER0201  [R0201]
R3  4.7K  R-WIDER0201  [R0201]
R4  100  R-WIDER0402  [R0402]
R5  5.1K  R-US_R0201  [R0201]
R8  100  R-WIDER0402  [R0402]
R9  100  R-WIDER0402  [R0402]
R18  12K 1%  R-US_SMALLR0402  [R0402]
R19  10K  R-US_SMALLR0201  [R0201]
R24  33  R-US_SMALLR0201  [R0201]
R25  33  R-US_SMALLR0201  [R0201]
R36  100  R-WIDER0402  [R0402]
R37  100  R-WIDER0402  [R0402]
R38  100  R-WIDER0402  [R0402]
R89  10K  R-US_SMALLR0201  [R0201]
R90  10K  R-US_SMALLR0201  [R0201]
R91  10K  R-US_SMALLR0201  [R0201]
R92  10K  R-US_SMALLR0201  [R0201]
R93  10K  R-US_SMALLR0201  [R0201]
R94  10K  R-US_SMALLR0201  [R0201]
R96  10k  R-US_SMALLR0201  [R0201]
R97  10k  R-US_SMALLR0201  [R0201]
R98  10k  R-US_SMALLR0201  [R0201]
R99  4.7k  R-US_SMALLR0201  [R0201]
R100  330  R-US_SMALLR0402  [R0402]
R101  2.21k  R-US_SMALLR0201  [R0201]
U2  FT2232HQ USB-UART/JTAG Bridge  FT2232HQ-QFN64  [FT2232HQ-QFN64]
U10  93LC46BT-I/SN  EEPROM-93LC46B-I/SN  [SOIC8]

### Nets
CLK-12M-FPGA: R25.2 ; also sheet 6
CLK-12M-FT: R24.2 U2.2(OSCI)
CLK-12M-SHARED: Q1.3 R24.1 R25.1
DONE: R38.1 R100.1 U2.22(ADBUS5)
EE-CLK: R96.1 U2.62(EECLK) U10.2(CLK)
EE-CS: R98.1 U2.63(EECS) U10.1(CS)
EE-DATA: R101.2 U2.61(EEDATA) U10.3(DI)
EE-DATA-DO: R97.1 R101.1 U10.4(DO)
FPGA-DONE: R38.2 ; also sheet 6
FPGA-INIT#: R1.1 ; also sheet 6
FPGA-TCK: R5.2 R36.2 ; also sheet 6
FPGA-TDI: R8.2 ; also sheet 6
FPGA-TDO: R37.2 ; also sheet 6
FPGA-TMS: R4.2 ; also sheet 6
FT-PWREN#: U2.60(PWREN#) ; also sheet 6
FT-REF: R18.2 U2.6(REF)
FT-RESETN: R19.1 U2.14(RESET#)
FT-VCORE: C39.2 C139.2 U2.12(VCORE) U2.37(VCORE) U2.49(VREGOUT) U2.64(VCORE)
FT-VPHY: C40.2 L4.1 U2.4(VPHY)
FT-VPLL: C41.2 L5.1 U2.9(VPLL)
GND: C38.1 C39.1 C40.1 C41.1 C133.1 C134.1 C135.1 C136.1 C137.1 C138.1 C139.1 JP3.3 Q1.2 R3.2 R5.1 R18.1 U2.1(GND) U2.5(GND) U2.10(AGND) U2.11(GND) U2.13(TEST) U2.15(GND) U2.25(GND) U2.35(GND) U2.47(GND) U2.51(GND) U2.EP U10.5(VSS) ; also sheet 2,3,4,6,7
PROG#: R9.1 R99.1 U2.21(ADBUS4)
RST#: R3.1 R9.2 ; also sheet 3,6
TCK: JP3.1 R36.1 R89.1 U2.16(ADBUS0)
TDI: JP4.1 R8.1 R90.1 U2.17(ADBUS1)
TDO: JP4.2 R37.1 R91.1 U2.18(ADBUS2)
TMS: JP3.2 R4.1 R92.1 U2.19(ADBUS3)
UART_FT_CTS#: R93.1 U2.41(BDBUS3) ; also sheet 6
UART_FT_DTR#: U2.43(BDBUS4) ; also sheet 6
UART_FT_RTS#: U2.40(BDBUS2) ; also sheet 6
UART_FT_RXD: R94.1 U2.39(BDBUS1) ; also sheet 6
UART_FT_TXD: U2.38(BDBUS0) ; also sheet 6
USB_D_N [usb-diff]: U2.7(DM) ; also sheet 2
USB_D_P [usb-diff]: U2.8(DP) ; also sheet 2
VCC3V3: C38.2 C133.2 C134.2 C135.2 C136.2 C137.2 C138.2 JP4.3 L4.2 L5.2 Q1.1 Q1.4 R1.2 R19.2 R89.2 R90.2 R91.2 R92.2 R93.2 R94.2 R96.2 R97.2 R98.2 R99.2 R100.2 U2.20(VCCIO) U2.31(VCCIO) U2.42(VCCIO) U2.50(VREGIN) U2.56(VCCIO) U10.8(VCC) ; also sheet 2,3,4,6,7
Unconnected: U2.3(OSCO) U2.23(ADBUS6) U2.24(ADBUS7) U2.26(ACBUS0) U2.27(ACBUS1) U2.28(ACBUS2) U2.29(ACBUS3) U2.30(ACBUS4) U2.32(ACBUS5) U2.33(ACBUS6) U2.34(ACBUS7) U2.36(SUSPEND#) U2.44(BDBUS5) U2.45(BDBUS6) U2.46(BDBUS7) U2.48(BCBUS0) U2.52(BCBUS1) U2.53(BCBUS2) U2.54(BCBUS3) U2.55(BCBUS4) U2.57(BCBUS5) U2.58(BCBUS6) U2.59(BCBUS7) U10.6(NC) U10.7(NC)

### Notes on the sheet
- FT2232HQ, JTAG, CLOCK

## Sheet 6 of 7: FPGA Connections
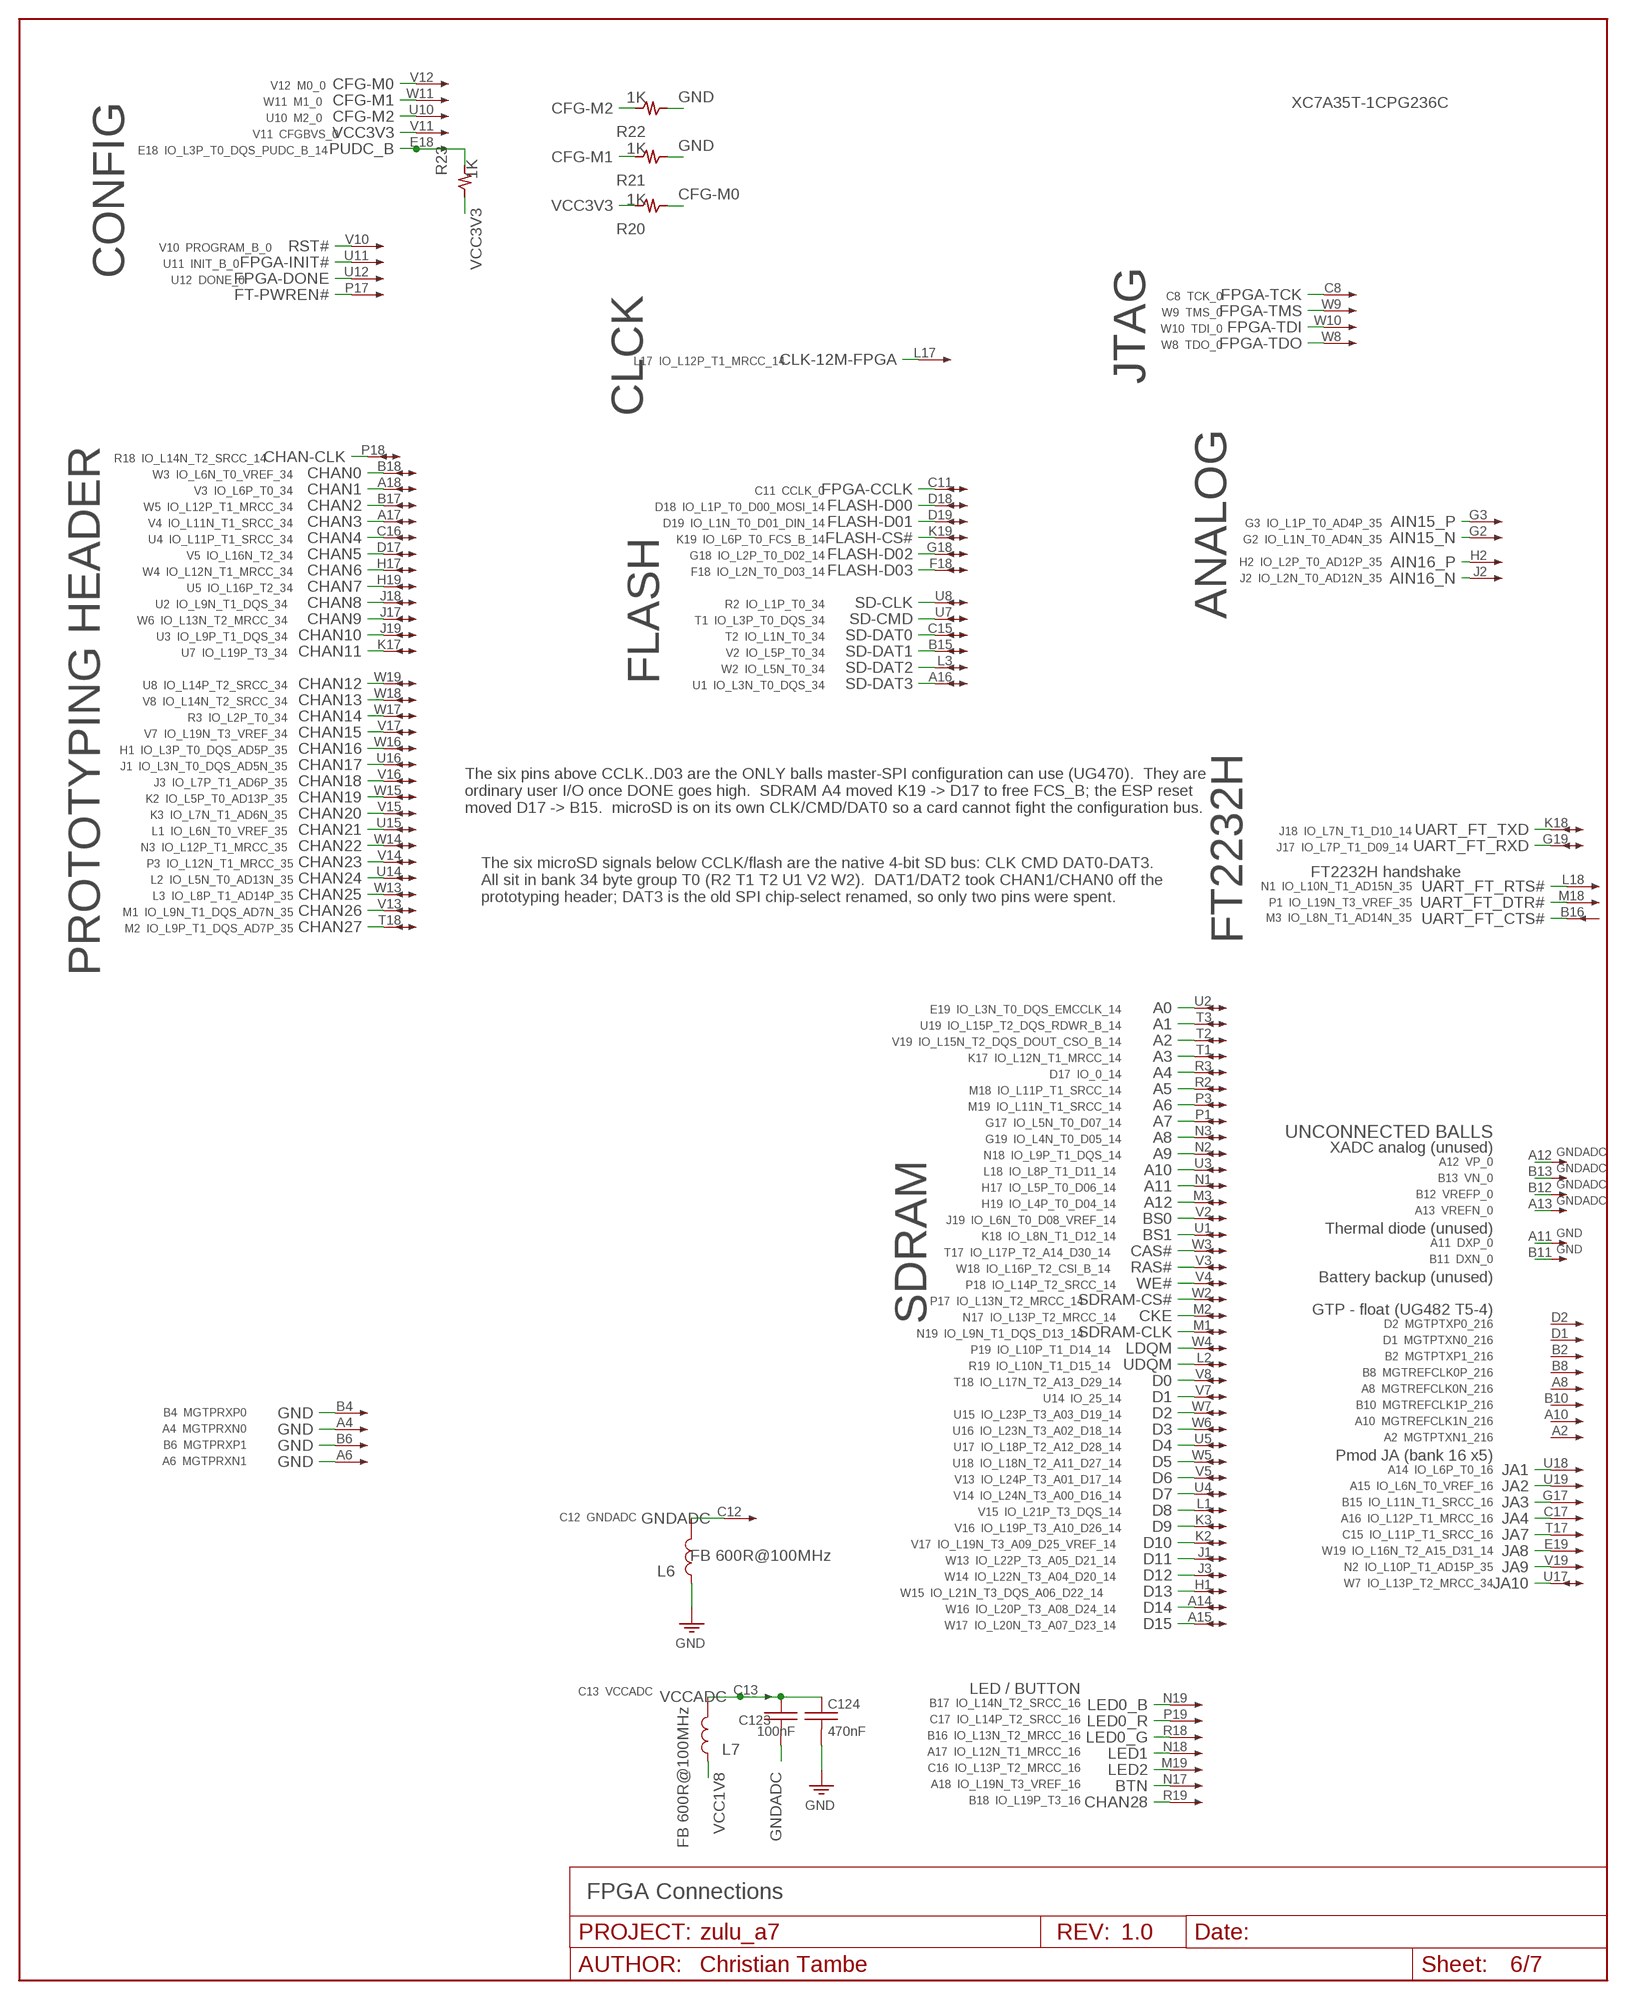
[diagram p5: schematic, sheet 6]

### Parts
C123  100nF  C-USC0402  [C0402]
C124  470nF  C-USC0402  [C0402]
L6  FB 600R@100MHz  INDUCTOR  [IND0603]
L7  FB 600R@100MHz  INDUCTOR  [IND0603]
R20  1K  R-US_SMALLR0402  [R0402]
R21  1K  R-US_SMALLR0402  [R0402]
R22  1K  R-US_SMALLR0402  [R0402]
R23  1K  R-US_SMALLR0402  [R0402]
U1  XC7A35T-1CPG236C  XC7A35T-CPG236-1CPG236C  [XC7A35T-CPG236]

### Nets
A0: U1.U2 ; also sheet 4
A1: U1.T3 ; also sheet 4
A2: U1.T2 ; also sheet 4
A3: U1.T1 ; also sheet 4
A4: U1.R3 ; also sheet 4
A5: U1.R2 ; also sheet 4
A6: U1.P3 ; also sheet 4
A7: U1.P1 ; also sheet 4
A8: U1.N3 ; also sheet 4
A9: U1.N2 ; also sheet 4
A10: U1.U3 ; also sheet 4
A11: U1.N1 ; also sheet 4
A12: U1.M3 ; also sheet 4
AIN15_N: U1.G2 ; also sheet 3
AIN15_P: U1.G3 ; also sheet 3
AIN16_N: U1.J2 ; also sheet 3
AIN16_P: U1.H2 ; also sheet 3
BS0: U1.V2 ; also sheet 4
BS1: U1.U1 ; also sheet 4
BTN: U1.N17 ; also sheet 3
CAS#: U1.W3 ; also sheet 4
CFG-M0: R20.1 U1.V12
CFG-M1: R21.2 U1.W11
CFG-M2: R22.2 U1.U10
CHAN0: U1.B18 ; also sheet 3
CHAN1: U1.A18 ; also sheet 3
CHAN2: U1.B17 ; also sheet 3
CHAN3: U1.A17 ; also sheet 3
CHAN4: U1.C16 ; also sheet 3
CHAN5: U1.D17 ; also sheet 3
CHAN6: U1.H17 ; also sheet 3
CHAN7: U1.H19 ; also sheet 3
CHAN8: U1.J18 ; also sheet 3
CHAN9: U1.J17 ; also sheet 3
CHAN10: U1.J19 ; also sheet 3
CHAN11: U1.K17 ; also sheet 3
CHAN12: U1.W19 ; also sheet 3
CHAN13: U1.W18 ; also sheet 3
CHAN14: U1.W17 ; also sheet 3
CHAN15: U1.V17 ; also sheet 3
CHAN16: U1.W16 ; also sheet 3
CHAN17: U1.U16 ; also sheet 3
CHAN18: U1.V16 ; also sheet 3
CHAN19: U1.W15 ; also sheet 3
CHAN20: U1.V15 ; also sheet 3
CHAN21: U1.U15 ; also sheet 3
CHAN22: U1.W14 ; also sheet 3
CHAN23: U1.V14 ; also sheet 3
CHAN24: U1.U14 ; also sheet 3
CHAN25: U1.W13 ; also sheet 3
CHAN26: U1.V13 ; also sheet 3
CHAN27: U1.T18 ; also sheet 3
CHAN28: U1.R19 ; also sheet 3
CHAN-CLK: U1.P18 ; also sheet 3
CKE: U1.M2 ; also sheet 4
CLK-12M-FPGA: U1.L17 ; also sheet 5
D0: U1.V8 ; also sheet 4
D1: U1.V7 ; also sheet 4
D2: U1.W7 ; also sheet 4
D3: U1.W6 ; also sheet 4
D4: U1.U5 ; also sheet 4
D5: U1.W5 ; also sheet 4
D6: U1.V5 ; also sheet 4
D7: U1.U4 ; also sheet 4
D8: U1.L1 ; also sheet 4
D9: U1.K3 ; also sheet 4
D10: U1.K2 ; also sheet 4
D11: U1.J1 ; also sheet 4
D12: U1.J3 ; also sheet 4
D13: U1.H1 ; also sheet 4
D14: U1.A14 ; also sheet 4
D15: U1.A15 ; also sheet 4
FLASH-CS#: U1.K19 ; also sheet 4
FLASH-D00: U1.D18 ; also sheet 4
FLASH-D01: U1.D19 ; also sheet 4
FLASH-D02: U1.G18 ; also sheet 4
FLASH-D03: U1.F18 ; also sheet 4
FPGA-CCLK: U1.C11 ; also sheet 4
FPGA-DONE: U1.U12 ; also sheet 5
FPGA-INIT#: U1.U11 ; also sheet 5
FPGA-TCK: U1.C8 ; also sheet 5
FPGA-TDI: U1.W10 ; also sheet 5
FPGA-TDO: U1.W8 ; also sheet 5
FPGA-TMS: U1.W9 ; also sheet 5
FT-PWREN#: U1.P17 ; also sheet 5
GND: C124.2 L6.1 R21.1 R22.1 U1.A4 U1.A6 U1.A11 U1.B4 U1.B6 U1.B11 ; also sheet 2,3,4,5,7
GNDADC: C123.2 L6.2 U1.A12 U1.A13 U1.B12 U1.B13 U1.C12
JA1: U1.U18 ; also sheet 3
JA2: U1.U19 ; also sheet 3
JA3: U1.G17 ; also sheet 3
JA4: U1.C17 ; also sheet 3
JA7: U1.T17 ; also sheet 3
JA8: U1.E19 ; also sheet 3
JA9: U1.V19 ; also sheet 3
JA10: U1.U17 ; also sheet 3
LDQM: U1.W4 ; also sheet 4
LED0_B: U1.N19 ; also sheet 3
LED0_G: U1.R18 ; also sheet 3
LED0_R: U1.P19 ; also sheet 3
LED1: U1.N18 ; also sheet 3
LED2: U1.M19 ; also sheet 3
PUDC_B: R23.2 U1.E18
RAS#: U1.V3 ; also sheet 4
RST#: U1.V10 ; also sheet 3,5
SD-CLK: U1.U8 ; also sheet 4
SD-CMD: U1.U7 ; also sheet 4
SD-DAT0: U1.C15 ; also sheet 4
SD-DAT1: U1.B15 ; also sheet 4
SD-DAT2: U1.L3 ; also sheet 4
SD-DAT3: U1.A16 ; also sheet 4
SDRAM-CLK: U1.M1 ; also sheet 4
SDRAM-CS#: U1.W2 ; also sheet 4
UART_FT_CTS#: U1.B16 ; also sheet 5
UART_FT_DTR#: U1.M18 ; also sheet 5
UART_FT_RTS#: U1.L18 ; also sheet 5
UART_FT_RXD: U1.G19 ; also sheet 5
UART_FT_TXD: U1.K18 ; also sheet 5
UDQM: U1.L2 ; also sheet 4
VCC1V8: L7.1 ; also sheet 2,3,7
VCC3V3: R20.2 R23.1 U1.V11 ; also sheet 2,3,4,5,7
VCCADC: C123.1 C124.1 L7.2 U1.C13
WE#: U1.V4 ; also sheet 4
Unconnected: U1.A2 U1.A8 U1.A10 U1.B2 U1.B8 U1.B10 U1.D1 U1.D2

### Notes on the sheet
- V12  M0_0
- W11  M1_0
- U10  M2_0
- V11  CFGBVS_0
- E18  IO_L3P_T0_DQS_PUDC_B_14
- V10  PROGRAM_B_0
- U11  INIT_B_0
- CONFIG | U12  DONE_0
- C8  TCK_0
- W9  TMS_0
- W10  TDI_0
- W8  TDO_0
- L17  IO_L12P_T1_MRCC_14
- JTAG
- CLCK
- R18  IO_L14N_T2_SRCC_14
- W3  IO_L6N_T0_VREF_34
- V3  IO_L6P_T0_34 | C11  CCLK_0
- W5  IO_L12P_T1_MRCC_34 | D18  IO_L1P_T0_D00_MOSI_14
- V4  IO_L11N_T1_SRCC_34 | D19  IO_L1N_T0_D01_DIN_14 | G3  IO_L1P_T0_AD4P_35
- U4  IO_L11P_T1_SRCC_34 | K19  IO_L6P_T0_FCS_B_14 | G2  IO_L1N_T0_AD4N_35
- V5  IO_L16N_T2_34 | G18  IO_L2P_T0_D02_14
- H2  IO_L2P_T0_AD12P_35
- W4  IO_L12N_T1_MRCC_34 | F18  IO_L2N_T0_D03_14
- J2  IO_L2N_T0_AD12N_35
- U5  IO_L16P_T2_34
- U2  IO_L9N_T1_DQS_34 | R2  IO_L1P_T0_34
- W6  IO_L13N_T2_MRCC_34 | T1  IO_L3P_T0_DQS_34 | ANALOG
- U3  IO_L9P_T1_DQS_34 | T2  IO_L1N_T0_34
- U7  IO_L19P_T3_34 | V2  IO_L5P_T0_34
- W2  IO_L5N_T0_34
- U8  IO_L14P_T2_SRCC_34 | FLASH | U1  IO_L3N_T0_DQS_34
- V8  IO_L14N_T2_SRCC_34
- R3  IO_L2P_T0_34
- V7  IO_L19N_T3_VREF_34
- H1  IO_L3P_T0_DQS_AD5P_35
- J1  IO_L3N_T0_DQS_AD5N_35
- J3  IO_L7P_T1_AD6P_35
- K2  IO_L5P_T0_AD13P_35
- K3  IO_L7N_T1_AD6N_35
- The six pins above CCLK..D03 are the ONLY balls master-SPI configuration can use (UG470).  They are
  ordinary user I/O once DONE goes high.  SDRAM A4 moved K19 -> D17 to free FCS_B; the ESP reset
  moved D17 -> B15.  microSD is on its own CLK/CMD/DAT0 so a card cannot fight the configuration bus.
- L1  IO_L6N_T0_VREF_35 | J18  IO_L7N_T1_D10_14
- N3  IO_L12P_T1_MRCC_35 | J17  IO_L7P_T1_D09_14
- P3  IO_L12N_T1_MRCC_35
- FT2232H handshake
- L2  IO_L5N_T0_AD13N_35
- N1  IO_L10N_T1_AD15N_35
- L3  IO_L8P_T1_AD14P_35
- P1  IO_L19N_T3_VREF_35
- The six microSD signals below CCLK/flash are the native 4-bit SD bus: CLK CMD DAT0-DAT3.
  All sit in bank 34 byte group T0 (R2 T1 T2 U1 V2 W2).  DAT1/DAT2 took CHAN1/CHAN0 off the
  prototyping header; DAT3 is the old SPI chip-select renamed, so only two pins were spent.
- M1  IO_L9N_T1_DQS_AD7N_35
- M3  IO_L8N_T1_AD14N_35
- M2  IO_L9P_T1_DQS_AD7P_35
- FT2232H
- PROTOTYPING HEADER
- E19  IO_L3N_T0_DQS_EMCCLK_14
- U19  IO_L15P_T2_DQS_RDWR_B_14
- V19  IO_L15N_T2_DQS_DOUT_CSO_B_14
- K17  IO_L12N_T1_MRCC_14
- D17  IO_0_14
- M18  IO_L11P_T1_SRCC_14
- M19  IO_L11N_T1_SRCC_14
- G17  IO_L5N_T0_D07_14
- UNCONNECTED BALLS
- G19  IO_L4N_T0_D05_14
- XADC analog (unused)
- N18  IO_L9P_T1_DQS_14
- A12  VP_0
- L18  IO_L8P_T1_D11_14
- B13  VN_0
- H17  IO_L5P_T0_D06_14
- B12  VREFP_0
- H19  IO_L4P_T0_D04_14
- A13  VREFN_0
- J19  IO_L6N_T0_D08_VREF_14
- Thermal diode (unused)
- K18  IO_L8N_T1_D12_14
- A11  DXP_0
- T17  IO_L17P_T2_A14_D30_14
- B11  DXN_0
- W18  IO_L16P_T2_CSI_B_14
- Battery backup (unused)
- P18  IO_L14P_T2_SRCC_14
- P17  IO_L13N_T2_MRCC_14
- GTP - float (UG482 T5-4)
- N17  IO_L13P_T2_MRCC_14
- D2  MGTPTXP0_216
- SDRAM
- N19  IO_L9N_T1_DQS_D13_14
- D1  MGTPTXN0_216
- P19  IO_L10P_T1_D14_14
- B2  MGTPTXP1_216
- R19  IO_L10N_T1_D15_14
- B8  MGTREFCLK0P_216
- T18  IO_L17N_T2_A13_D29_14
- A8  MGTREFCLK0N_216
- U14  IO_25_14
- B10  MGTREFCLK1P_216
- B4  MGTPRXP0 | U15  IO_L23P_T3_A03_D19_14
- A10  MGTREFCLK1N_216
- A4  MGTPRXN0 | U16  IO_L23N_T3_A02_D18_14
- A2  MGTPTXN1_216
- B6  MGTPRXP1 | U17  IO_L18P_T2_A12_D28_14
- Pmod JA (bank 16 x5)
- A6  MGTPRXN1 | U18  IO_L18N_T2_A11_D27_14
- A14  IO_L6P_T0_16
- V13  IO_L24P_T3_A01_D17_14
- A15  IO_L6N_T0_VREF_16
- V14  IO_L24N_T3_A00_D16_14
- B15  IO_L11N_T1_SRCC_16
- V15  IO_L21P_T3_DQS_14
- C12  GNDADC | A16  IO_L12P_T1_MRCC_16
- V16  IO_L19P_T3_A10_D26_14
- C15  IO_L11P_T1_SRCC_16
- V17  IO_L19N_T3_A09_D25_VREF_14
- W19  IO_L16N_T2_A15_D31_14
- W13  IO_L22P_T3_A05_D21_14
- N2  IO_L10P_T1_AD15P_35
- W14  IO_L22N_T3_A04_D20_14
- W7  IO_L13P_T2_MRCC_34
- W15  IO_L21N_T3_DQS_A06_D22_14
- W16  IO_L20P_T3_A08_D24_14
- W17  IO_L20N_T3_A07_D23_14
- LED / BUTTON
- C13  VCCADC
- B17  IO_L14N_T2_SRCC_16
- C17  IO_L14P_T2_SRCC_16
- B16  IO_L13N_T2_MRCC_16
- A17  IO_L12N_T1_MRCC_16
- C16  IO_L13P_T2_MRCC_16
- A18  IO_L19N_T3_VREF_16
- B18  IO_L19P_T3_16
- FPGA Connections

## Sheet 7 of 7: FPGA POWER
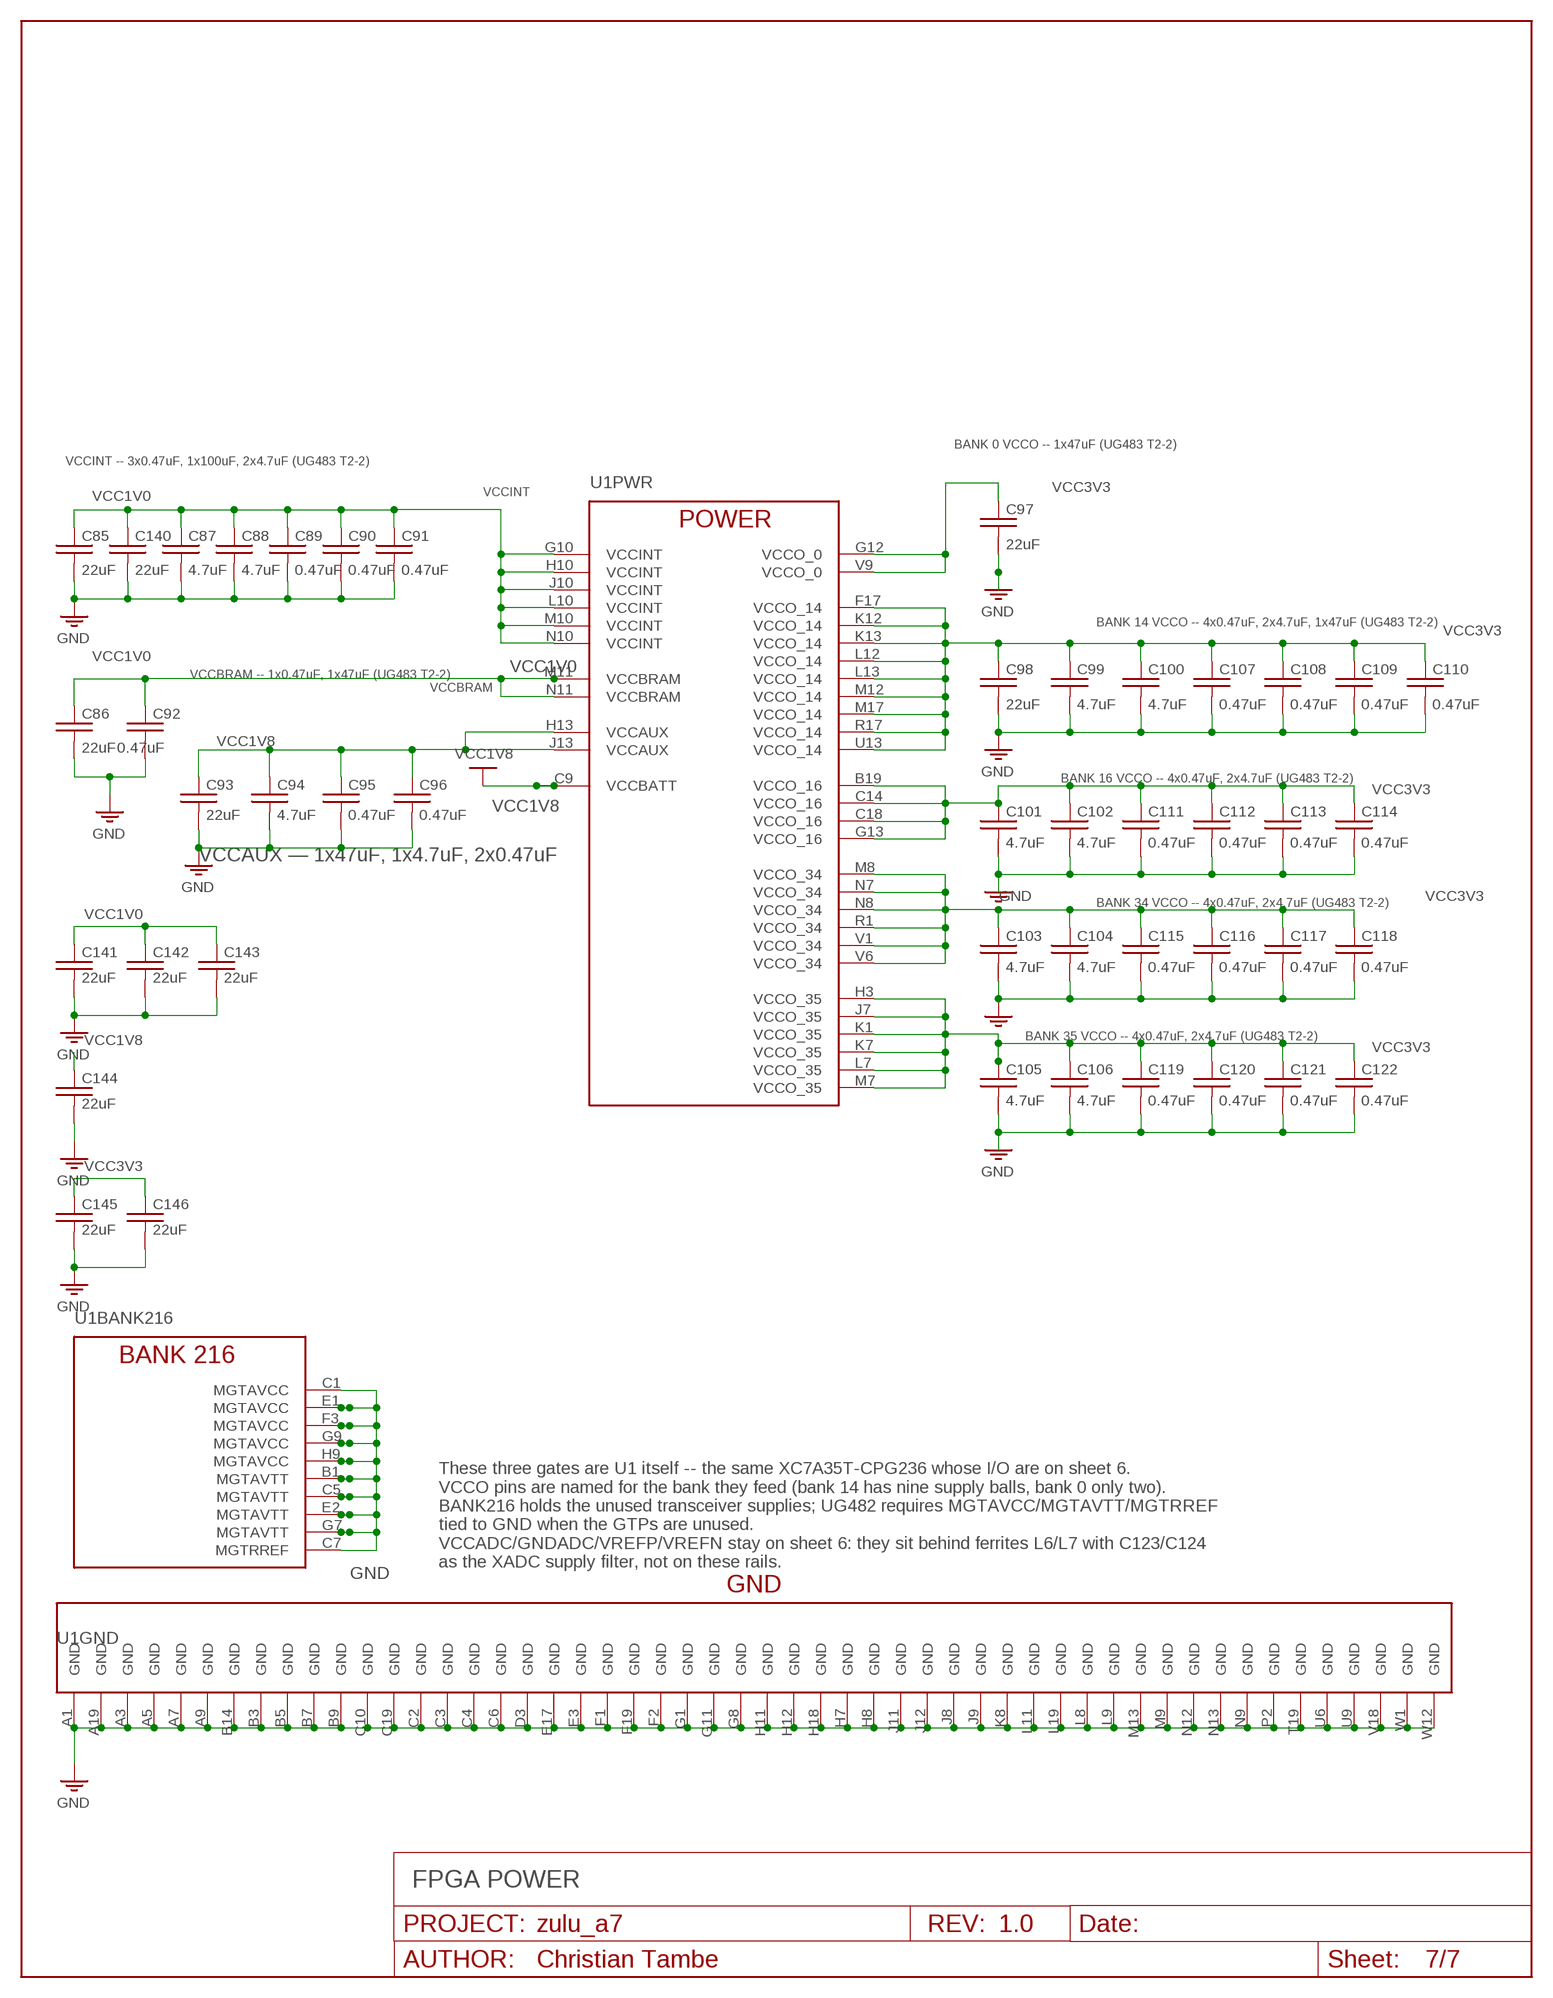
[diagram p6: schematic, sheet 7]

### Parts
C85  22uF  C-USC0805  [C0805]
C86  22uF  C-USC0805  [C0805]
C87  4.7uF  C-USC0603  [C0603]
C88  4.7uF  C-USC0603  [C0603]
C89  0.47uF  C-USC0201  [C0201]
C90  0.47uF  C-USC0201  [C0201]
C91  0.47uF  C-USC0201  [C0201]
C92  0.47uF  C-USC0201  [C0201]
C93  22uF  C-USC0805  [C0805]
C94  4.7uF  C-USC0603  [C0603]
C95  0.47uF  C-USC0201  [C0201]
C96  0.47uF  C-USC0201  [C0201]
C97  22uF  C-USC0805  [C0805]
C98  22uF  C-USC0805  [C0805]
C99  4.7uF  C-USC0603  [C0603]
C100  4.7uF  C-USC0603  [C0603]
C101  4.7uF  C-USC0603  [C0603]
C102  4.7uF  C-USC0603  [C0603]
C103  4.7uF  C-USC0603  [C0603]
C104  4.7uF  C-USC0603  [C0603]
C105  4.7uF  C-USC0603  [C0603]
C106  4.7uF  C-USC0603  [C0603]
C107  0.47uF  C-USC0201  [C0201]
C108  0.47uF  C-USC0201  [C0201]
C109  0.47uF  C-USC0201  [C0201]
C110  0.47uF  C-USC0201  [C0201]
C111  0.47uF  C-USC0201  [C0201]
C112  0.47uF  C-USC0201  [C0201]
C113  0.47uF  C-USC0201  [C0201]
C114  0.47uF  C-USC0201  [C0201]
C115  0.47uF  C-USC0201  [C0201]
C116  0.47uF  C-USC0201  [C0201]
C117  0.47uF  C-USC0201  [C0201]
C118  0.47uF  C-USC0201  [C0201]
C119  0.47uF  C-USC0201  [C0201]
C120  0.47uF  C-USC0201  [C0201]
C121  0.47uF  C-USC0201  [C0201]
C122  0.47uF  C-USC0201  [C0201]
C140  22uF  C-USC0805  [C0805]
C141  22uF  C-USC0805  [C0805]
C142  22uF  C-USC0805  [C0805]
C143  22uF  C-USC0805  [C0805]
C144  22uF  C-USC0805  [C0805]
C145  22uF  C-USC0805  [C0805]
C146  22uF  C-USC0805  [C0805]

### Nets
GND: C85.2 C86.2 C87.2 C88.2 C89.2 C90.2 C91.2 C92.2 C93.2 C94.2 C95.2 C96.2 C97.2 C98.2 C99.2 C100.2 C101.2 C102.2 C103.2 C104.2 C105.2 C106.2 C107.2 C108.2 C109.2 C110.2 C111.2 C112.2 C113.2 C114.2 C115.2 C116.2 C117.2 C118.2 C119.2 C120.2 C121.2 C122.2 C140.2 C141.2 C142.2 C143.2 C144.2 C145.2 C146.2 U1.A1(GND:GND) U1.A3(GND:GND) U1.A5(GND:GND) U1.A7(GND:GND) U1.A9(GND:GND) U1.A19(GND:GND) U1.B1(BANK216:MGTAVTT) U1.B3(GND:GND) U1.B5(GND:GND) U1.B7(GND:GND) U1.B9(GND:GND) U1.B14(GND:GND) U1.C1(BANK216:MGTAVCC) U1.C2(GND:GND) U1.C3(GND:GND) U1.C4(GND:GND) U1.C5(BANK216:MGTAVTT) U1.C6(GND:GND) U1.C7(BANK216:MGTRREF) U1.C10(GND:GND) U1.C19(GND:GND) U1.D3(GND:GND) U1.E1(BANK216:MGTAVCC) U1.E2(BANK216:MGTAVTT) U1.E3(GND:GND) U1.E17(GND:GND) U1.F1(GND:GND) U1.F2(GND:GND) U1.F3(BANK216:MGTAVCC) U1.F19(GND:GND) U1.G1(GND:GND) U1.G7(BANK216:MGTAVTT) U1.G8(GND:GND) U1.G9(BANK216:MGTAVCC) U1.G11(GND:GND) U1.H7(GND:GND) U1.H8(GND:GND) U1.H9(BANK216:MGTAVCC) U1.H11(GND:GND) U1.H12(GND:GND) U1.H18(GND:GND) U1.J8(GND:GND) U1.J9(GND:GND) U1.J11(GND:GND) U1.J12(GND:GND) U1.K8(GND:GND) U1.L8(GND:GND) U1.L9(GND:GND) U1.L11(GND:GND) U1.L19(GND:GND) U1.M9(GND:GND) U1.M13(GND:GND) U1.N9(GND:GND) U1.N12(GND:GND) U1.N13(GND:GND) U1.P2(GND:GND) U1.T19(GND:GND) U1.U6(GND:GND) U1.U9(GND:GND) U1.V18(GND:GND) U1.W1(GND:GND) U1.W12(GND:GND) ; also sheet 2,3,4,5,6
VCC1V0: C85.1 C86.1 C87.1 C88.1 C89.1 C90.1 C91.1 C92.1 C140.1 C141.1 C142.1 C143.1 U1.G10(PWR:VCCINT) U1.H10(PWR:VCCINT) U1.J10(PWR:VCCINT) U1.L10(PWR:VCCINT) U1.M10(PWR:VCCINT) U1.M11(PWR:VCCBRAM) U1.N10(PWR:VCCINT) U1.N11(PWR:VCCBRAM) ; also sheet 2,3,6
VCC1V8: C93.1 C94.1 C95.1 C96.1 C144.1 U1.C9(PWR:VCCBATT) U1.H13(PWR:VCCAUX) U1.J13(PWR:VCCAUX) ; also sheet 2,3,6
VCC3V3: C97.1 C98.1 C99.1 C100.1 C101.1 C102.1 C103.1 C104.1 C105.1 C106.1 C107.1 C108.1 C109.1 C110.1 C111.1 C112.1 C113.1 C114.1 C115.1 C116.1 C117.1 C118.1 C119.1 C120.1 C121.1 C122.1 C145.1 C146.1 U1.B19(PWR:VCCO_16) U1.C14(PWR:VCCO_16) U1.C18(PWR:VCCO_16) U1.F17(PWR:VCCO_14) U1.G12(PWR:VCCO_0) U1.G13(PWR:VCCO_16) U1.H3(PWR:VCCO_35) U1.J7(PWR:VCCO_35) U1.K1(PWR:VCCO_35) U1.K7(PWR:VCCO_35) U1.K12(PWR:VCCO_14) U1.K13(PWR:VCCO_14) U1.L7(PWR:VCCO_35) U1.L12(PWR:VCCO_14) U1.L13(PWR:VCCO_14) U1.M7(PWR:VCCO_35) U1.M8(PWR:VCCO_34) U1.M12(PWR:VCCO_14) U1.M17(PWR:VCCO_14) U1.N7(PWR:VCCO_34) U1.N8(PWR:VCCO_34) U1.R1(PWR:VCCO_34) U1.R17(PWR:VCCO_14) U1.U13(PWR:VCCO_14) U1.V1(PWR:VCCO_34) U1.V6(PWR:VCCO_34) U1.V9(PWR:VCCO_0) ; also sheet 2,3,4,5,6

### Notes on the sheet
- BANK 0 VCCO -- 1x47uF (UG483 T2-2)
- VCCINT -- 3x0.47uF, 1x100uF, 2x4.7uF (UG483 T2-2)
- VCCINT
- BANK 14 VCCO -- 4x0.47uF, 2x4.7uF, 1x47uF (UG483 T2-2)
- VCCBRAM -- 1x0.47uF, 1x47uF (UG483 T2-2)
- VCCBRAM
- BANK 16 VCCO -- 4x0.47uF, 2x4.7uF (UG483 T2-2)
- VCCAUX — 1x47uF, 1x4.7uF, 2x0.47uF
- BANK 34 VCCO -- 4x0.47uF, 2x4.7uF (UG483 T2-2)
- BANK 35 VCCO -- 4x0.47uF, 2x4.7uF (UG483 T2-2)
- These three gates are U1 itself -- the same XC7A35T-CPG236 whose I/O are on sheet 6.
  VCCO pins are named for the bank they feed (bank 14 has nine supply balls, bank 0 only two).
  BANK216 holds the unused transceiver supplies; UG482 requires MGTAVCC/MGTAVTT/MGTRREF
  tied to GND when the GTPs are unused.
  VCCADC/GNDADC/VREFP/VREFN stay on sheet 6: they sit behind ferrites L6/L7 with C123/C124
  as the XADC supply filter, not on these rails.
- FPGA POWER